# EasyEDA Pro project ZYNQ7020核心板配套底板1.0.epro, board PCB1
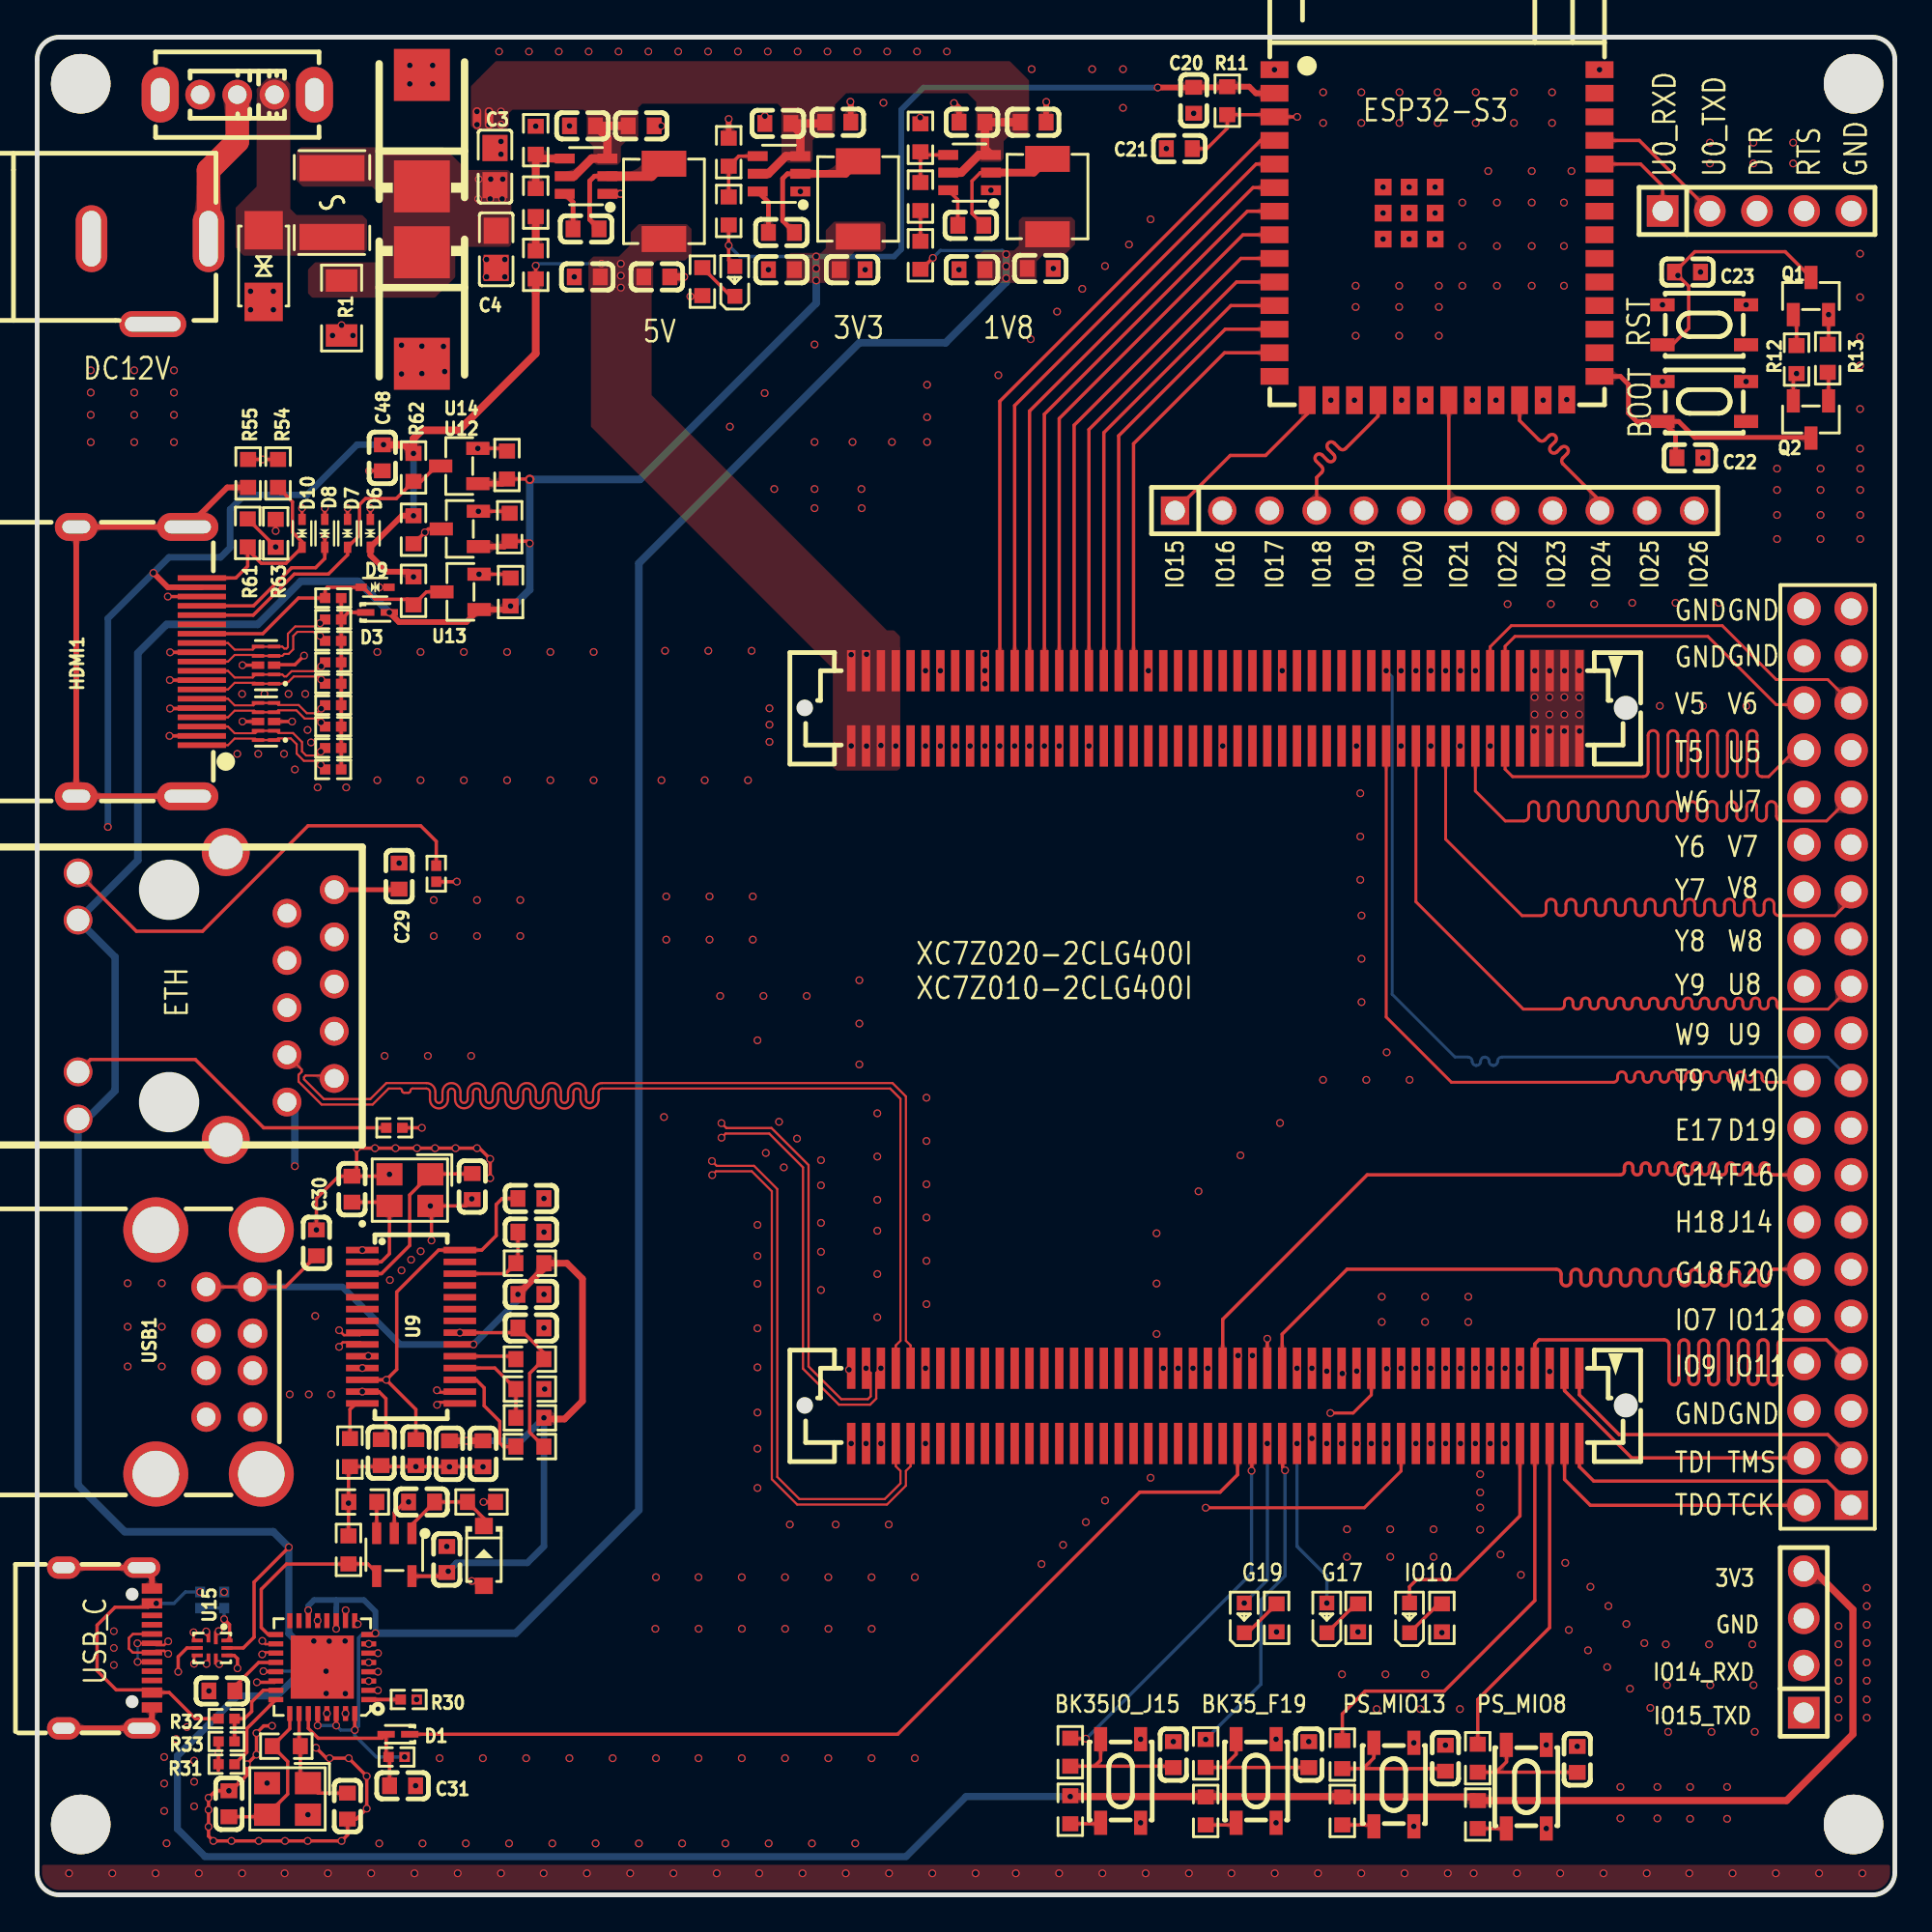
[diagram p9: board, top side]
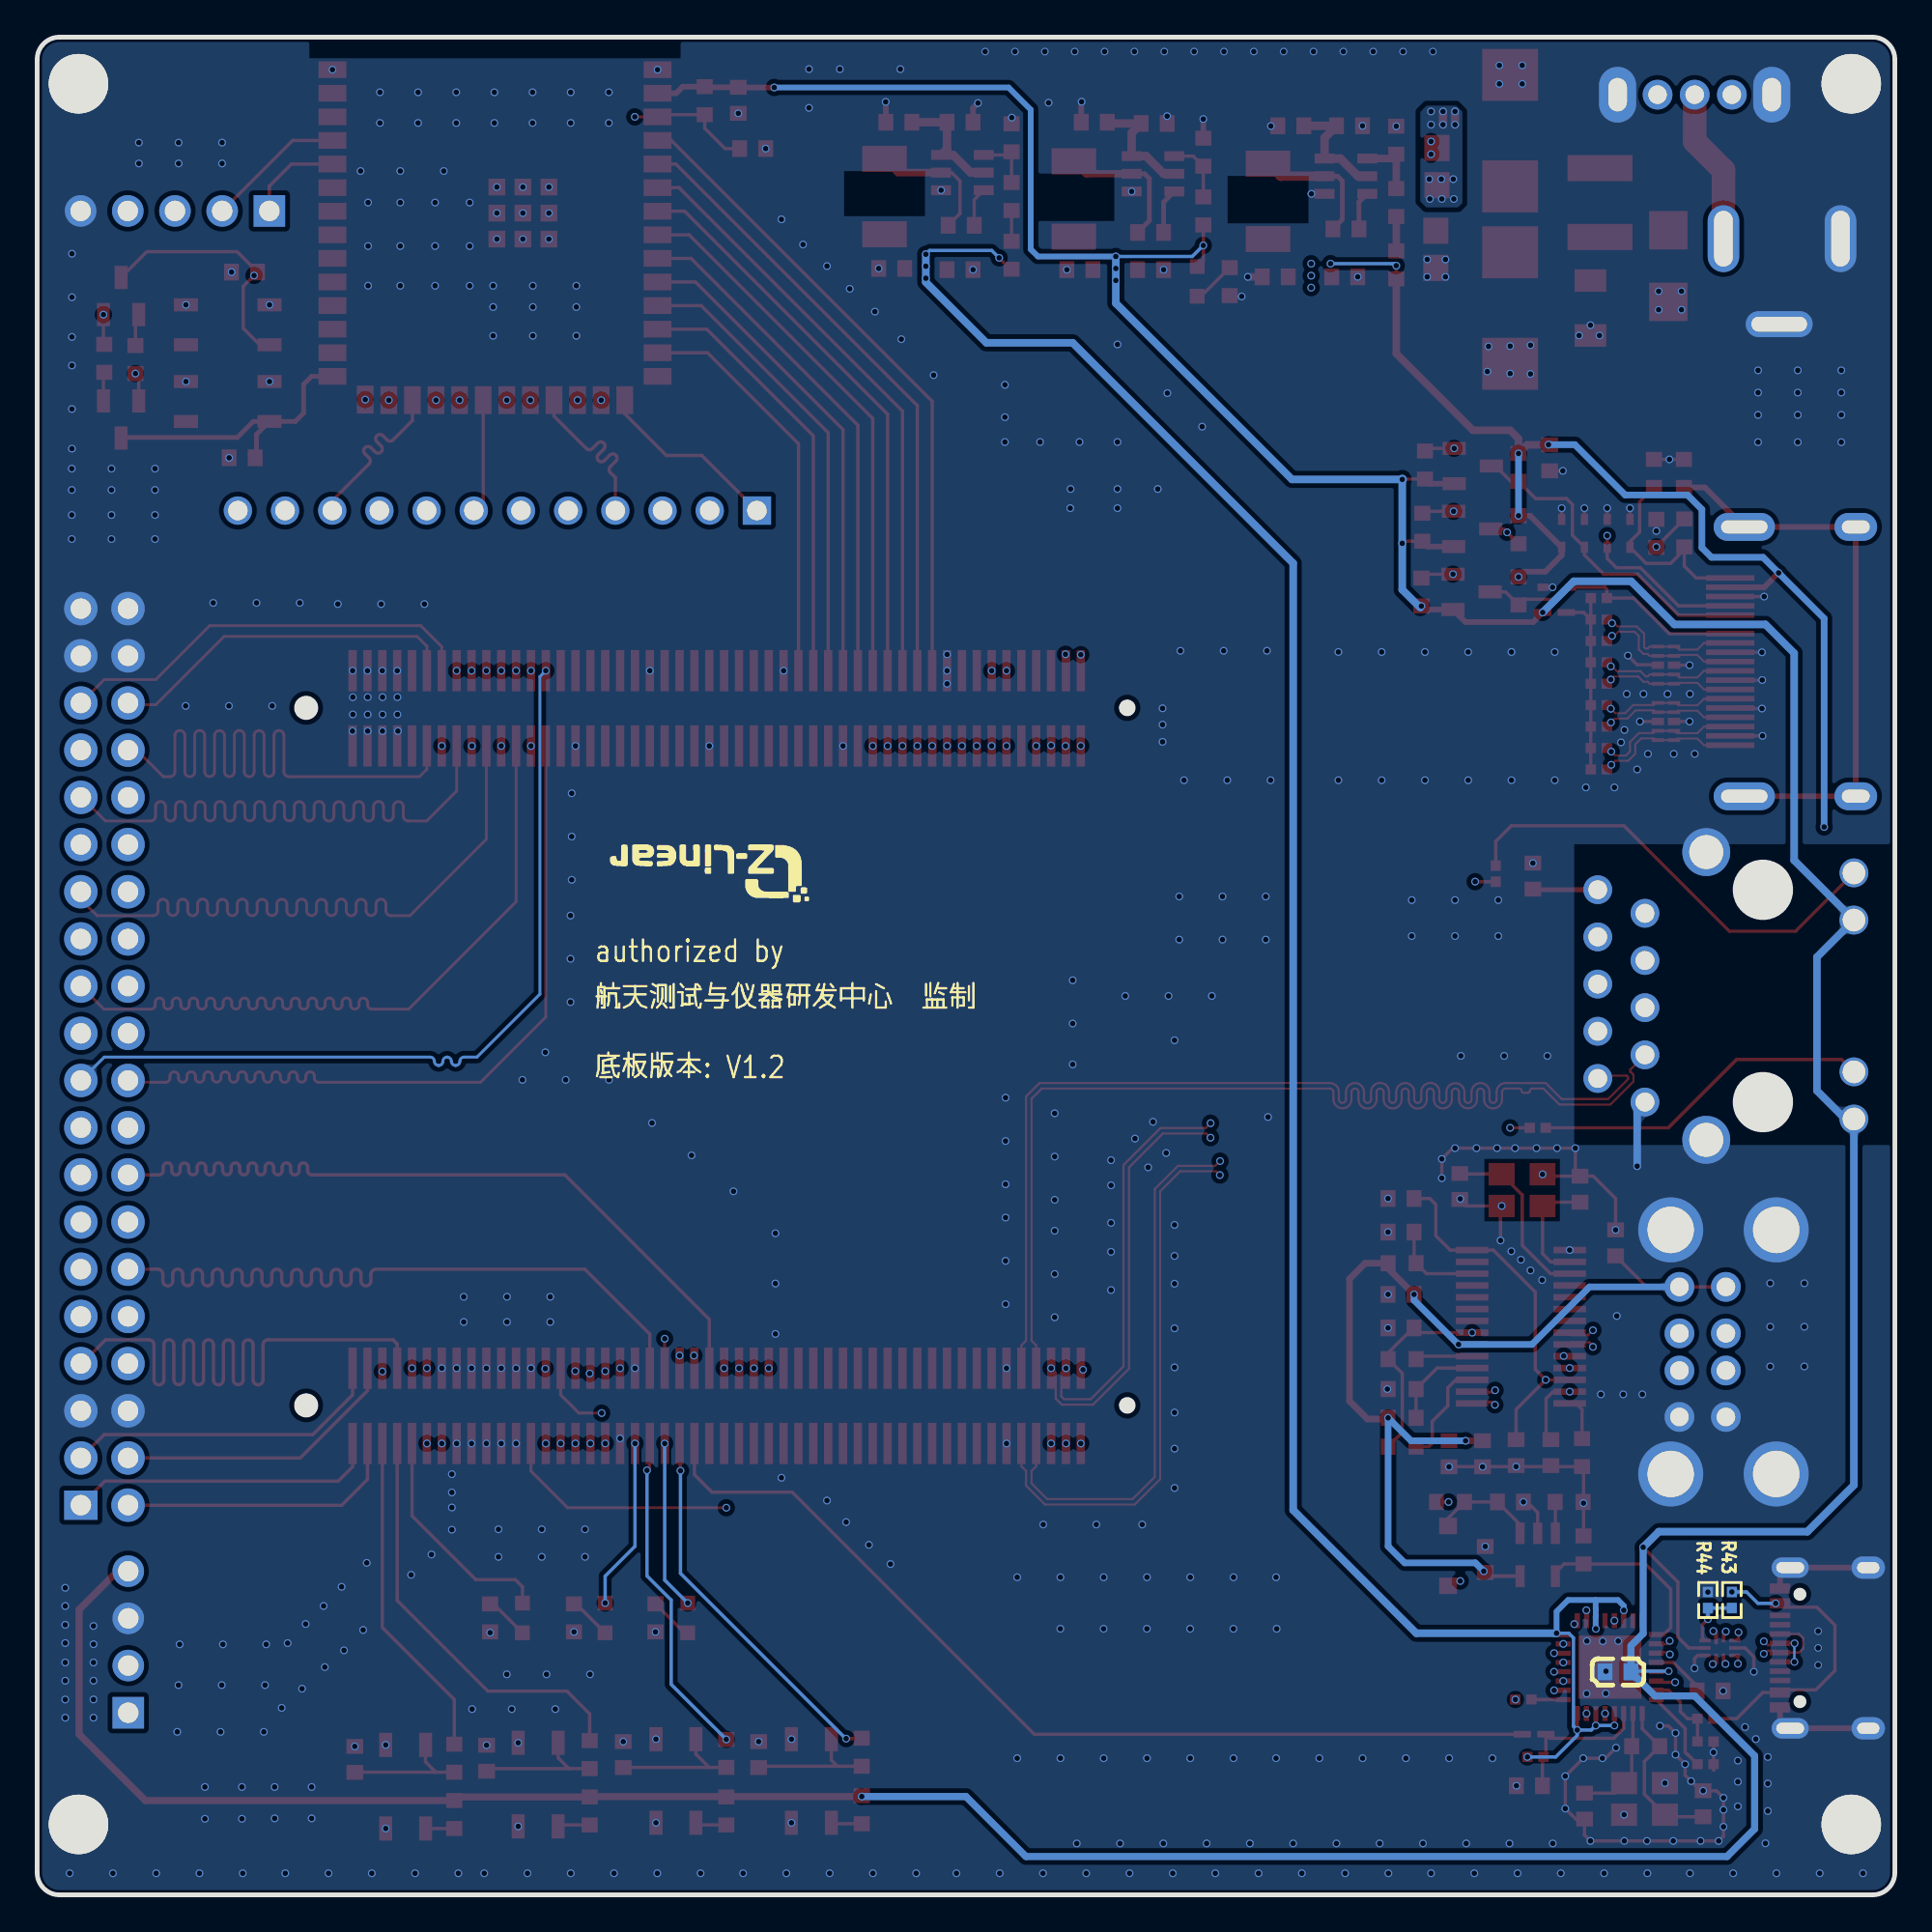
[diagram p10: board, bottom side, seen from below]

Outline 100 x 100 mm; copper layers: Top Layer, Inner1, Inner2, Inner3, Inner4, Bottom Layer. Coordinates in mm from the lower left corner of the outline.
Outline path: 0,98.8 arc(0.35,99.65) 1.2,100 98.8,100 arc(99.65,99.65) 100,98.8 100,1.2 arc(99.65,0.35) 98.8,0 1.2,0 arc(0.35,0.35) 0,1.2 0,98.8
Stack: Top Layer 0.035mm 外层铜厚1oz / Dielectric1 0.0994mm 3313 RC57% 4.2mil / Inner1 0.0152mm 内层铜厚 / Dielectric2 0.55mm 0.55mm H/H No copper / Inner2 0.0152mm 内层铜厚 / Dielectric3 0.1088mm 2116 RC54% 4.9mil / Inner3 0.0152mm 内层铜厚 / Dielectric4 0.55mm 0.55mm H/H No copper / Inner4 0.0152mm 内层铜厚 / Dielectric5 0.0994mm 3313 RC57% 4.2mil / Bottom Layer 0.035mm 外层铜厚1oz

## Design rules (mm)
net $2N1180: ESP32-1
net $2N1190: ESP32-1
net OTG_DM: USB_OTG
net OTG_DP: USB_OTG
net HOST_DP: USB_HOST
net SLAVE_DP: USB_SLAVE
net SLAVE_DM: USB_SLAVE
net HOST_DM: USB_HOST
net DM1: USB_HOST_F1
net DP1: USB_HOST_F1
net DM2: USB_HOST_F2
net DP2: USB_HOST_F2
net BK13_V5: Pin_OUT
net BK13_T5: Pin_OUT
net BK13_V6: Pin_OUT
net BK13_U5: Pin_OUT
net BK13_W6: Pin_OUT
net BK13_U7: Pin_OUT
net BK13_Y6: Pin_OUT
net BK13_V7: Pin_OUT
net BK13_Y7: Pin_OUT
net BK13_V8: Pin_OUT
net BK13_Y8: Pin_OUT
net BK13_W8: Pin_OUT
net BK13_Y9: Pin_OUT
net BK13_U8: Pin_OUT
net BK13_W9: Pin_OUT
net BK13_U9: Pin_OUT
net BK13_W10: Pin_OUT
net BK13_T9: Pin_OUT
net PS500_MIO9: Pin_OUT
net PS500_MIO11: Pin_OUT
net PS500_MIO7: Pin_OUT
net PS500_MIO12: Pin_OUT
net PS501_MIO35_OTG_D3: USB_DATA
net PS501_MIO37_OTG_D5: USB_DATA
net PS501_MIO38_OTG_D6: USB_DATA
net PS501_MIO34_OTG_D2: USB_DATA
net PS501_MIO36_OTG_CLK: USB_DATA
net PS501_MIO32_OTG_D0: USB_DATA
net PS501_MIO29_OTG_DIR: USB_DATA
net PS501_MIO33_OTG_D1: USB_DATA
net PS501_MIO30_OTG_STP: USB_DATA
net PS501_MIO28_OTG_D4: USB_DATA
net PS501_MIO31_OTG_NXT: USB_DATA
net PS501_MIO39_OTG_D7: USB_DATA
net BK35_G18: Pin_OUT
net BK35_F20: Pin_OUT
net BK35_H18: Pin_OUT
net BK35_J14: Pin_OUT
net BK35_IO_0--G14: Pin_OUT
net BK35_F16: Pin_OUT
net BK35_D19: Pin_OUT
net PHY_MDI3_N: PHY_MDI3
net PHY_MDI1_N: PHY_MDI1
net PHY_MDI3_P: PHY_MDI3
net PHY_MDI1_P: PHY_MDI1
net PHY_MDI2_N: PHY_MDI2
net PHY_MDI0_N: PHY_MDI0
net PHY_MDI2_P: PHY_MDI2
net PHY_MDI0_P: PHY_MDI0
net HDMI_TX2_P: HDMI_TX2
net HDMI_TX2_N: HDMI_TX2
net HDMI_TX1_P: HDMI_TX1
net HDMI_TX1_N: HDMI_TX1
net HDMI_TX0_P: HDMI_TX0
net HDMI_TX0_N: HDMI_TX0
net HDMI_TXC_N: HDMI_TXC
net HDMI_TXC_P: HDMI_TXC
net $2N3028: ESP32-1
net $2N3030: ESP32-1
net $2N3032: ESP32-1
net $2N3034: ESP32-1
net $2N3036: ESP32-1
net $2N3038: ESP32-1
net $2N3040: ESP32-1
net $2N3042: ESP32-1
net $2N3044: ESP32-1
net $2N3046: ESP32-1
net $2N3048: ESP32-1
net $2N3050: ESP32-1
template: 自定义配置
spacing copperThickness1oz (default): track to track 0.165, other pairs 0.14 to 0.3
spacing copperThickness2oz: track to track 0.203, other pairs 0.152 to 0.3
track width copperThickness1oz (default): min 0.102, default 0.178, max 2.54
track width USB_DATA: min 0.163, default 0.163, max 0.165
track width PWR_5V: min 0.127, default 0.356, max 2.54
differential pair differentialPair (default): width min 0.102, default 0.102, max 2.54; gap min 0.178, default 0.178
differential pair USB_SLAVE1: width min 0.13, default 0.13, max 0.132; gap min 0.178, default 0.178
differential pair USB_OTG: width min 0.13, default 0.13, max 0.132; gap min 0.178, default 0.178
differential pair USB_HOST: width min 0.15, default 0.15, max 0.152; gap min 0.178, default 0.178
differential pair HDMI_TX2: width min 0.109, default 0.109, max 0.117; gap min 0.178, default 0.178
differential pair HDMI_TX1: width min 0.107, default 0.109, max 0.117; gap min 0.178, default 0.178
differential pair HDMI_TX0: width min 0.107, default 0.109, max 0.117; gap min 0.178, default 0.178
differential pair PHY_MDI1: width min 0.114, default 0.114, max 0.114; gap min 0.178, default 0.178
differential pair PHY_MDI2: width min 0.119, default 0.119, max 0.119; gap min 0.178, default 0.178
differential pair PHY_MDI3: width min 0.117, default 0.117, max 0.119; gap min 0.178, default 0.178
via viaSize (default): diameter min 0.401, default 0.406, max 10; hole min 0.302, default 0.302, max 6.299
net class USB_DATA uses USB_DATA
net 5V uses PWR_5V
net OTG_DM uses USB_OTG
net OTG_DP uses USB_OTG
net HOST_DP uses USB_HOST
net SLAVE_DP uses USB_SLAVE1
net SLAVE_DM uses USB_SLAVE1
net HOST_DM uses USB_HOST
net DM1 uses USB_OTG
net DP1 uses USB_OTG
net DM2 uses USB_OTG
net DP2 uses USB_OTG
net PS501_MIO35_OTG_D3 uses USB_DATA
net PS501_MIO37_OTG_D5 uses USB_DATA
net PS501_MIO38_OTG_D6 uses USB_DATA
net PS501_MIO34_OTG_D2 uses USB_DATA
net PS501_MIO36_OTG_CLK uses USB_DATA
net PS501_MIO32_OTG_D0 uses USB_DATA
net PS501_MIO29_OTG_DIR uses USB_DATA
net PS501_MIO33_OTG_D1 uses USB_DATA
net PS501_MIO30_OTG_STP uses USB_DATA
net PS501_MIO28_OTG_D4 uses USB_DATA
net PS501_MIO31_OTG_NXT uses USB_DATA
net PS501_MIO39_OTG_D7 uses USB_DATA
net PHY_MDI3_N uses PHY_MDI3
net PHY_MDI1_N uses PHY_MDI1
net PHY_MDI3_P uses PHY_MDI3
net PHY_MDI1_P uses PHY_MDI1
net PHY_MDI2_N uses PHY_MDI2
net PHY_MDI0_N uses PHY_MDI2
net PHY_MDI2_P uses PHY_MDI2
net PHY_MDI0_P uses PHY_MDI2
net HDMI_TX2_P uses HDMI1, HDMI_TX2
net HDMI_TX2_N uses HDMI1, HDMI_TX2
net HDMI_TX1_P uses HDMI1, HDMI_TX1
net HDMI_TX1_N uses HDMI1, HDMI_TX1
net HDMI_TX0_P uses HDMI1, HDMI_TX0
net HDMI_TX0_N uses HDMI1, HDMI_TX0
net HDMI_TXC_N uses HDMI1, HDMI_TX0
net HDMI_TXC_P uses HDMI1, HDMI_TX0
diff pair USB_OTG uses USB_OTG
diff pair USB_HOST uses USB_HOST
diff pair USB_SLAVE uses USB_SLAVE1
diff pair USB_HOST_F1 uses USB_OTG
diff pair USB_HOST_F2 uses USB_OTG
diff pair PHY_MDI3 uses PHY_MDI3
diff pair PHY_MDI1 uses PHY_MDI1
diff pair PHY_MDI2 uses PHY_MDI2
diff pair PHY_MDI0 uses PHY_MDI2
diff pair HDMI_TX2 uses HDMI_TX2
diff pair HDMI_TX1 uses HDMI_TX1
diff pair HDMI_TX0 uses HDMI_TX0
diff pair HDMI_TXC uses HDMI_TX0
eq len grp HDMI01 uses HDMI1

## Placement (name value [footprint] x y rotation side)
C1  100uF  [CASE-D_7343]  20.71 94.97 270 top
C2  100uF  [CASE-D_7343]  20.71 85.42 90 top
C3  100nF  [C0805]  24.64 93.03 270 top
C4  100nF  [C0805]  24.71 88.58 90 top
C5  100nF  [C0603]  29.55 89.68 0 top
C6  10uF  [C0603]  32.52 95.23 180 top
C7  100nF  [C0603]  29.35 95.23 0 top
C8  10uF  [C0603]  33.35 87.1 180 top
C9  100nF  [C0603]  29.61 87.1 0 top
C10  100nF  [C0603]  40.06 89.48 0 top
C11  10uF  [C0603]  39.87 95.35 0 top
C12  100nF  [C0603]  43.1 95.42 180 top
C13  10uF  [C0603]  43.87 87.48 180 top
C14  100nF  [C0603]  40.06 87.48 0 top
C15  100nF  [C0603]  50.26 89.87 0 top
C16  10uF  [C0603]  53.61 95.42 180 top
C17  100nF  [C0603]  50.32 95.42 0 top
C18  10uF  [C0603]  54 87.55 180 top
C19  100nF  [C0603]  50.32 87.48 0 top
C20  100nF  [C0603]  62.26 96.6 90 top
C21  100nF  [C0603]  61.48 94 0 top
C22  100nF  [C0603]  88.97 77.35 180 top
C23  100nF  [C0603]  88.84 87.35 180 top
C24  100nF  [C0603]  61.16 7.55 270 top
C25  100nF  [C0603]  68.45 7.55 270 top
C26  100nF  [C0603]  75.81 7.35 270 top
C27  100nF  [C0603]  82.9 7.29 270 top
C29  100nF  [C0603]  19.48 54.84 90 top
C30  100nF  [C0603]  15.03 35.1 90 top
C31  10uF  [C0603]  19.67 5.87 180 top
C32  100nF  [C0603]  24 23.74 90 top
C33  20pF  [C0603]  10.32 4.9 270 top
C34  20pF  [C0603]  16.7 4.78 90 top
C35  100nF  [C0603]  9.94 10.98 0 top
C36  100nF  [C0603]  26.58 37.48 0 top
C37  100nF  [C0603]  26.58 35.68 0 top
C38  100nF  [C0603]  26.58 30.52 0 top
C39  100nF  [C0603]  22.19 23.74 270 top
C40  100nF  [C0603]  26.58 32.32 180 top
C41  100nF  [C0603]  20.39 23.81 270 top
C42  100nF  [C0603]  18.52 23.81 270 top
C43  100nF  [C0603]  20.69 21.15 180 top
C44  18pF  [C0603]  23.42 38.13 270 top
C45  18pF  [C0603]  16.95 37.99 90 top
C46  100nF  [C0603]  22.05 18.05 90 top
C47  100nF  [C0603]  14.9 12 0 bottom
C48  100nF  [C0603]  18.58 77.35 90 top
CN1  IPCB08371FA0S7V  [CONN-SMD_100P-P0.80_10144517-103XXX]  63.42 26.32 0 top
CN2  IPCB08371FA0S7V  [CONN-SMD_100P-P0.80_10144517-103XXX]  63.42 63.87 0 top
D1  RB521S-30  [SOD-523_L1.2-W0.8-LS1.6-RD]  19.42 8.65 180 top
D2  1N4148W  [SOD-123_L2.7-W1.6-LS3.7-FD]  24.05 18.25 90 top
D3  RB521S-30  [SOD-523_L1.2-W0.8-LS1.6-RD]  18.32 69.03 0 top
D4  RCLAMP0524P  [DFN2510-10_L2.5-W1.0-P0.50-BL]  12.32 63.16 90 top
D5  RCLAMP0524P  [DFN2510-10_L2.5-W1.0-P0.50-BL]  12.32 66.19 90 top
D6  TPESD5B5.0ST1G  [SOD-523_L1.2-W0.8-LS1.6-BI]  17.94 73.29 270 top
D7  TPESD5B5.0ST1G  [SOD-523_L1.2-W0.8-LS1.6-BI]  16.71 73.29 270 top
D8  TPESD5B5.0ST1G  [SOD-523_L1.2-W0.8-LS1.6-BI]  15.48 73.29 270 top
D9  TPESD5B5.0ST1G  [SOD-523_L1.2-W0.8-LS1.6-BI]  18.19 70.39 180 top
D10  TPESD5B5.0ST1G  [SOD-523_L1.2-W0.8-LS1.6-BI]  14.26 73.29 270 top
F1  SMD1812P150TF/24  [F1812]  15.87 91.1 90 top
H1  PZ254V-11-05P  [HDR-TH_5P-P2.54-V-M]  92.58 90.64 0 top
H2  PZ254V-11-04P  [HDR-TH_4P-P2.54-V-M]  95.1 13.61 90 top
H3  PZ254V-11-12P  [HDR-TH_12P-P2.54-V-M]  75.23 74.52 0 top
HDMI1  HDMI 19PIN 043  [HDMI-SMD_HDMI-19PIN-043]  5.48 66.39 270 top
L1  3.3uH  [IND-SMD_L4.4-W4.2-A]  33.74 91.16 90 top
L2  3.3uH  [IND-SMD_L4.4-W4.2-A]  44.19 91.29 90 top
L3  3.3uH  [IND-SMD_L4.4-W4.2-A]  54.39 91.42 90 top
LED1  -  [LED_0603]  37.55 86.9 90 top
LED2  -  [LED_0603]  64.97 14.96 90 top
LED3  -  [LED_0603]  69.42 14.96 90 top
LED4  -  [LED_0603]  73.87 14.96 90 top
Q1  SS8050  [SOT-23-3_L2.9-W1.3-P1.90-LS2.4-BR]  95.48 86.06 270 top
Q2  SS8050  [SOT-23-3_L2.9-W1.3-P1.90-LS2.4-BR]  95.48 79.42 90 top
R1  RL1206A180K  [R1206]  16.39 85.42 90 top
R2  115kΩ  [R0603]  26.84 91.1 270 top
R3  115kΩ  [R0603]  26.84 87.74 270 top
R4  20kΩ  [R0603]  26.84 94.45 270 top
R5  100kΩ  [R0603]  37.23 90.64 270 top
R6  30kΩ  [R0603]  37.23 93.81 270 top
R7  40.2kΩ  [R0603]  47.55 91.42 270 top
R8  40.2kΩ  [R0603]  47.55 88.26 270 top
R9  30kΩ  [R0603]  47.55 94.58 270 top
R10  4.7kΩ  [R0603]  35.81 86.84 90 top
R11  10kΩ  [R0603]  64.06 96.58 90 top
R12  10kΩ  [R0603]  94.71 82.64 270 top
R13  10kΩ  [R0603]  96.39 82.71 90 top
R14  4.7kΩ  [R0603]  55.61 4.58 270 top
R15  1kΩ  [R0603]  55.61 7.68 270 top
R16  4.7kΩ  [R0603]  66.72 14.91 90 top
R17  4.7kΩ  [R0603]  62.9 4.52 270 top
R18  1kΩ  [R0603]  62.9 7.61 270 top
R19  4.7kΩ  [R0603]  71.1 14.91 90 top
R20  4.7kΩ  [R0603]  70.26 4.52 270 top
R21  1kΩ  [R0603]  70.26 7.55 270 top
R22  4.7kΩ  [R0603]  75.62 14.91 90 top
R23  4.7kΩ  [R0603]  77.55 4.32 270 top
R24  1kΩ  [R0603]  77.55 7.35 270 top
R26  240Ω  [R0402]  19.23 41.29 0 top
R27  240Ω  [R0402]  21.48 54.97 270 top
R28  1.5kΩ  [R0402]  19.35 7.42 0 top
R29  1MΩ  [R0603]  13.41 8 180 top
R30  33Ω  [R0402]  20 10.52 180 top
R31  10kΩ  [R0402]  10.19 7.03 180 top
R32  1kΩ  [R0402]  10.19 9.48 180 top
R33  10kΩ  [R0402]  10.19 8.26 180 top
R34  10kΩ  [R0603]  26.53 34 180 top
R35  100kΩ  [R0603]  26.53 28.84 180 top
R36  100kΩ  [R0603]  26.53 24.13 180 top
R37  47kΩ  [R0603]  26.53 25.68 0 top
R38  100kΩ  [R0603]  26.53 27.23 180 top
R39  2.7kΩ  [R0603]  16.84 23.81 270 top
R40  1kΩ  [R0603]  23.92 21.15 0 top
R41  10kΩ  [R0603]  16.76 18.57 270 top
R42  13.7kΩ  [R0603]  17.53 21.15 0 top
R43  1kΩ  [R0402]  8.77 15.87 90 bottom
R44  10kΩ  [R0402]  10.06 15.87 90 bottom
R45  49.9Ω  [R0402]  15.94 60.58 0 top
R46  49.9Ω  [R0402]  15.94 61.73 0 top
R47  49.9Ω  [R0402]  15.94 62.89 0 top
R48  49.9Ω  [R0402]  15.94 64.04 0 top
R49  49.9Ω  [R0402]  15.94 65.19 0 top
R50  49.9Ω  [R0402]  15.94 66.35 0 top
R51  49.9Ω  [R0402]  15.94 67.5 0 top
R52  49.9Ω  [R0402]  15.94 68.65 0 top
R53  49.9Ω  [R0402]  15.94 69.81 0 top
R54  10kΩ  [R0603]  12.97 76.52 270 top
R55  0Ω  [R0603]  11.36 76.52 270 top
R56  4.7kΩ  [R0603]  25.44 73.62 270 top
R57  4.7kΩ  [R0603]  20.26 73.48 90 top
R58  4.7kΩ  [R0603]  25.48 70.13 270 top
R59  4.7kΩ  [R0603]  20.26 70.19 90 top
R60  4.7kΩ  [R0603]  25.29 76.97 270 top
R61  20kΩ  [R0603]  11.33 73.31 90 top
R62  4.7kΩ  [R0603]  20.26 76.84 90 top
R63  20kΩ  [R0603]  12.84 73.29 90 top
RJ1  HY911130A  [RJ45-TH_10P-P2.54-S2.54_L16.1-W21.4_HY911130A]  9.1 48.39 270 top
SW1  TS-KG89S-AT25F  [SW-SMD_4P-L4.2-W3.3-P2.15-LS5.1]  89.74 80.39 0 top
SW2  TS-KG89S-AT25F  [SW-SMD_4P-L4.2-W3.3-P2.15-LS5.1]  89.74 84.52 0 top
SW3  TS-KG89S-AT25F  [SW-SMD_4P-L4.2-W3.3-P2.15-LS5.1]  58.32 6.13 90 top
SW4  TS-KG89S-AT25F  [SW-SMD_4P-L4.2-W3.3-P2.15-LS5.1]  65.62 6.13 90 top
SW5  TS-KG89S-AT25F  [SW-SMD_4P-L4.2-W3.3-P2.15-LS5.1]  73.03 5.94 90 top
SW6  TS-KG89S-AT25F  [SW-SMD_4P-L4.2-W3.3-P2.15-LS5.1]  80.16 5.82 90 top
TP1  -  [M3螺丝]  2.41 3.73 0 top
TP2  -  [M3螺丝]  2.41 97.43 0 top
TP3  -  [M3螺丝]  97.84 97.43 0 top
TP4  -  [M3螺丝]  97.84 3.73 0 top
U1  SS12D07VG4  [SW-TH_SS12D07VG4]  10.77 96.9 180 top
U2  DC005-2.5  [DC-IN-TH_DC005-2.5MM]  6.08 86.85 0 top
U3  SMAJ13CA  [DO-214AC_L4.3-W2.7-LS5.0-BI]  12.19 87.68 90 top
U4  TP6327GS6  [SOT-23-6_L2.9-W1.6-P0.95-LS2.8-BL]  29.55 92.52 90 top
U5  TP6327GS6  [SOT-23-6_L2.9-W1.6-P0.95-LS2.8-BL]  39.93 92.64 90 top
U6  TP6327GS6  [SOT-23-6_L2.9-W1.6-P0.95-LS2.8-BL]  50.19 92.71 90 top
U7  ESP32-S3-WROOM-1-N16R8  [WIRELM-SMD_ESP32-S3-WROOM-1]  75.35 89.35 0 top
U8  USB3320C-EZK  [QFN-32_L5.0-W5.0-P0.50-BL-EP3.4]  15.35 12.26 90 top
U9  FE1.1S-BSOP28BCN  [SSOP-28_L9.9-W3.9-P0.635-LS6.0-BL-1]  20.13 30.58 270 top
U10  LPW5209AB5F  [SOT-23-5_L3.0-W1.7-P0.95-LS2.8-BL]  19.22 18.31 180 top
U12  2SK3018  [SOT-23-3_L2.9-W1.3-P0.95-LS2.4-BR]  22.75 73.53 0 top
U13  2SK3018  [SOT-23-3_L2.9-W1.3-P0.95-LS2.4-BR]  22.79 70.14 0 top
U14  2SK3018  [SOT-23-3_L2.9-W1.3-P0.95-LS2.4-BR]  22.72 76.91 0 top
U15  TS3USB30ERSWR  [UQFN-10_L1.8-W1.4-P0.40-TL]  9.42 13.29 270 top
U16  PZ2.54-2*20  [HDR-TH_40P-P2.54-V-M-R2-C20-S2.54]  96.38 45.11 90 top
USB1  USB-269-BRW  [USB-A-TH_USB-269-BRW]  9.23 29.23 90 top
USB2  TYPE-C 16PIN 2MD(073)  [USB-C-SMD_TYPE-C-6PIN-2MD-073]  3.81 13.29 270 top
X1  24MHz  [CRYSTAL-SMD_4P-L3.2-W2.5-BL]  13.48 5.16 180 top
X2  12MHz  [CRYSTAL-SMD_4P-L3.2-W2.5-BL]  20.06 37.94 180 top

## Footprints (pads in the part's own frame, mm; a bottom-side part is the same pattern mirrored in y, then rotated)
C0603
  rect 0.8x0.9 smd: 1(-0.7,0) 2(0.7,0)
C0805
  rect 1.41x1.35 smd: 1(-1,0) 2(1,0)
CASE-D_7343
  rect 2.799x3.01 smd: 1(3,0) 2(-3,0)
CONN-SMD_100P-P0.80_10144517-103XXX
  rect 0.45x2.22 smd: 1(19.6,2.025) 2(19.6,-2.025) 3(18.8,2.025) 4(18.8,-2.025) 5(18,2.025) 6(18,-2.025) 7(17.2,2.025) 8(17.2,-2.025) 9(16.4,2.025) 10(16.4,-2.025) 11(15.6,2.025) 12(15.6,-2.025) 13(14.8,2.025) 14(14.8,-2.025) 15(14,2.025) 16(14,-2.025) 17(13.2,2.025) 18(13.2,-2.025) 19(12.4,2.025) 20(12.4,-2.025) 21(11.6,2.025) 22(11.6,-2.025) 23(10.8,2.025) 24(10.8,-2.025) 25(10,2.025) 26(10,-2.025) 27(9.2,2.025) 28(9.2,-2.025) 29(8.4,2.025) 30(8.4,-2.025) 31(7.6,2.025) 32(7.6,-2.025) 33(6.8,2.025) 34(6.8,-2.025) 35(6,2.025) 36(6,-2.025) 37(5.2,2.025) 38(5.2,-2.025) 39(4.4,2.025) 40(4.4,-2.025) 41(3.6,2.025) 42(3.6,-2.025) 43(2.8,2.025) 44(2.8,-2.025) 45(2,2.025) 46(2,-2.025) 47(1.2,2.025) 48(1.2,-2.025) 49(0.4,2.025) 50(0.4,-2.025) 51(-0.4,2.025) 52(-0.4,-2.025) 53(-1.2,2.025) 54(-1.2,-2.025) 55(-2,2.025) 56(-2,-2.025) 57(-2.8,2.025) 58(-2.8,-2.025) 59(-3.6,2.025) 60(-3.6,-2.025) 61(-4.4,2.025) 62(-4.4,-2.025) 63(-5.2,2.025) 64(-5.2,-2.025) 65(-6,2.025) 66(-6,-2.025) 67(-6.8,2.025) 68(-6.8,-2.025) 69(-7.6,2.025) 70(-7.6,-2.025) 71(-8.4,2.025) 72(-8.4,-2.025) 73(-9.2,2.025) 74(-9.2,-2.025) 75(-10,2.025) 76(-10,-2.025) 77(-10.8,2.025) 78(-10.8,-2.025) 79(-11.6,2.025) 80(-11.6,-2.025) 81(-12.4,2.025) 82(-12.4,-2.025) 83(-13.2,2.025) 84(-13.2,-2.025) 85(-14,2.025) 86(-14,-2.025) 87(-14.8,2.025) 88(-14.8,-2.025) 89(-15.6,2.025) 90(-15.6,-2.025) 91(-16.4,2.025) 92(-16.4,-2.025) 93(-17.2,2.025) 94(-17.2,-2.025) 95(-18,2.025) 96(-18,-2.025) 97(-18.8,2.025) 98(-18.8,-2.025) 99(-19.6,2.025) 100(-19.6,-2.025)
CRYSTAL-SMD_4P-L3.2-W2.5-BL
  rect 1.4x1.2 smd: 1(-1.1,-0.85) 2(1.1,-0.85) 3(1.1,0.85) 4(-1.1,0.85)
DC-IN-TH_DC005-2.5MM
  oval 3.6x1.4 hole 3x0.8: 2(0.15,-2.3)
  oval 1.7x3.6 hole 1x3: 3(-3.15,2.3) 4(3.15,2.3)
DFN2510-10_L2.5-W1.0-P0.50-BL
  rect 0.2x0.665 smd: 1(-1,-0.433) 2(-0.5,-0.433) 4(0.5,-0.433) 5(1,-0.433) 6(1,0.433) 7(0.5,0.433) 9(-0.5,0.433) 10(-1,0.433)
  rect 0.4x0.665 smd: 3(0,-0.433) 8(0,0.433)
DO-214AC_L4.3-W2.7-LS5.0-BI
  rect 2.07x2.06 smd: 1(-1.929,0) 2(1.929,0)
F1812
  rect 1.407x3.499 smd: 1(-1.853,0) 2(1.853,0)
HDMI-SMD_HDMI-19PIN-043
  rect 0.3x2.6 smd: 1(4.5,3.38) 2(4,3.38) 3(3.5,3.38) 4(3,3.38) 5(2.5,3.38) 6(2,3.38) 7(1.5,3.38) 8(1,3.38) 9(0.5,3.38) 10(0,3.38) 11(-0.5,3.38) 12(-1,3.38) 13(-1.5,3.38) 14(-2,3.38) 15(-2.5,3.38) 16(-3,3.38) 17(-3.5,3.38) 18(-4,3.38) 19(-4.5,3.38)
  oval 1.5x3.3 hole 0.7x2.5: 20(-7.25,2.62) 20(7.25,2.62)
  oval 1.5x2.3 hole 0.7x1.5: 20(-7.25,-3.38) 20(7.25,-3.38)
HDR-TH_4P-P2.54-V-M
  rect 1.7x1.7 hole 1.1: 1(-3.81,0)
  round 1.7 hole 1.1: 2(-1.27,0) 3(1.27,0) 4(3.81,0)
HDR-TH_5P-P2.54-V-M
  rect 1.7x1.7 hole 1.1: 1(-5.08,0)
  round 1.7 hole 1.1: 2(-2.54,0) 3(0,0) 4(2.54,0) 5(5.08,0)
HDR-TH_12P-P2.54-V-M
  rect 1.524x1.524 hole 1.05: 1(-13.97,0)
  round 1.524 hole 1.05: 2(-11.43,0) 3(-8.89,0) 4(-6.35,0) 5(-3.81,0) 6(-1.27,0) 7(1.27,0) 8(3.81,0) 9(6.35,0) 10(8.89,0) 11(11.43,0) 12(13.97,0)
HDR-TH_40P-P2.54-V-M-R2-C20-S2.54
  rect 1.575x1.8 hole 1.1: 1(-24.13,-1.27)
  round 1.8 hole 1.1: 2(-24.13,1.27) 3(-21.59,-1.27) 4(-21.59,1.27) 5(-19.05,-1.27) 6(-19.05,1.27) 7(-16.51,-1.27) 8(-16.51,1.27) 9(-13.97,-1.27) 10(-13.97,1.27) 11(-11.43,-1.27) 12(-11.43,1.27) 13(-8.89,-1.27) 14(-8.89,1.27) 15(-6.35,-1.27) 16(-6.35,1.27) 17(-3.81,-1.27) 18(-3.81,1.27) 19(-1.27,-1.27) 20(-1.27,1.27) 21(1.27,-1.27) 22(1.27,1.27) 23(3.81,-1.27) 24(3.81,1.27) 25(6.35,-1.27) 26(6.35,1.27) 27(8.89,-1.27) 28(8.89,1.27) 29(11.43,-1.27) 30(11.43,1.27) 31(13.97,-1.27) 32(13.97,1.27) 33(16.51,-1.27) 34(16.51,1.27) 35(19.05,-1.27) 36(19.05,1.27) 37(21.59,-1.27) 38(21.59,1.27) 39(24.13,-1.27) 40(24.13,1.27)
IND-SMD_L4.4-W4.2-A
  rect 1.4x2.4 smd: 1(2.028,0) 2(-2.028,0)
LED_0603
  rect 0.8x0.8 smd: 1(-0.851,-0.01) 2(0.75,-0.005)
M3螺丝
  round 3.2 hole 3.2: 1(-0.064,0.064)
QFN-32_L5.0-W5.0-P0.50-BL-EP3.4
  rect 0.28x0.8 smd: 1(-1.75,-2.5) 2(-1.252,-2.5) 3(-0.751,-2.5) 4(-0.252,-2.5) 5(0.248,-2.5) 6(0.749,-2.5) 7(1.248,-2.5) 8(1.748,-2.5) 17(1.752,2.5) 18(1.252,2.5) 19(0.751,2.5) 20(0.252,2.5) 21(-0.248,2.5) 22(-0.749,2.5) 23(-1.248,2.5) 24(-1.748,2.5)
  rect 0.8x0.28 smd: 9(2.5,-1.748) 10(2.5,-1.248) 11(2.5,-0.748) 12(2.5,-0.248) 13(2.5,0.252) 14(2.5,0.752) 15(2.5,1.252) 16(2.5,1.752) 25(-2.5,1.75) 26(-2.5,1.25) 27(-2.5,0.75) 28(-2.5,0.25) 29(-2.5,-0.25) 30(-2.5,-0.75) 31(-2.5,-1.25) 32(-2.5,-1.75)
  rect 3.4x3.4 smd: 33(0,0)
R0402
  rect 0.566x0.54 smd: 1(-0.433,0) 2(0.433,0)
R0603
  rect 0.806x0.864 smd: 1(-0.753,0) 2(0.753,0)
R1206
  rect 1.208x1.701 smd: 1(-1.479,0) 2(1.479,0)
RJ45-TH_10P-P2.54-S2.54_L16.1-W21.4_HY911130A
  round 1.55 hole 1.016: 1(-5.72,6.895) 2(-4.45,4.355) 3(-3.18,6.895) 4(-1.91,4.355) 5(-0.64,6.895) 6(0.63,4.355) 7(1.9,6.895) 8(3.17,4.355) 9(4.44,6.895) 10(5.71,4.355)
  round 1.55 hole 1.219: 11(-6.625,-6.895) 12(-4.085,-6.895) 13(4.085,-6.895) 14(6.625,-6.895)
  round 2.58 hole 1.829: 15(-7.745,1.055) 16(7.745,1.055)
SOD-123_L2.7-W1.6-LS3.7-FD
  rect 0.88x0.96 smd: 1(-1.61,0) 2(1.61,0)
SOD-523_L1.2-W0.8-LS1.6-BI
  rect 0.6x0.4 smd: 1(-0.75,0) 2(0.75,0)
SOD-523_L1.2-W0.8-LS1.6-RD
  rect 0.93x0.36 smd: 1(-0.635,0) 2(0.635,0)
SOT-23-3_L2.9-W1.3-P0.95-LS2.4-BR
  rect 1.25x0.7 smd: 1(1,-0.95) 2(1,0.95) 3(-1,0)
SOT-23-3_L2.9-W1.3-P1.90-LS2.4-BR
  rect 1.25x0.7 smd: 1(1,-0.95) 2(1,0.95) 3(-1,0)
SOT-23-5_L3.0-W1.7-P0.95-LS2.8-BL
  rect 0.49x1.157 smd: 1(-0.95,-1.153) 2(0,-1.153) 3(0.95,-1.153)
  rect 0.49x1.175 smd: 4(0.95,1.153) 5(-0.95,1.153)
SOT-23-6_L2.9-W1.6-P0.95-LS2.8-BL
  rect 0.532x1.072 smd: 1(-0.95,-1.149) 2(0,-1.149) 3(0.95,-1.149) 4(0.95,1.149) 5(0,1.149) 6(-0.95,1.149)
SSOP-28_L9.9-W3.9-P0.635-LS6.0-BL-1
  rect 0.35x1.751 smd: 1(-4.128,-2.626) 2(-3.493,-2.626) 3(-2.857,-2.626) 4(-2.223,-2.626) 5(-1.587,-2.626) 6(-0.953,-2.626) 7(-0.318,-2.626) 8(0.318,-2.626) 9(0.953,-2.626) 10(1.587,-2.626) 11(2.223,-2.626) 12(2.857,-2.626) 13(3.493,-2.626) 14(4.128,-2.626) 15(4.128,2.626) 16(3.493,2.626) 17(2.857,2.626) 18(2.223,2.626) 19(1.587,2.626) 20(0.953,2.626) 21(0.318,2.626) 22(-0.318,2.626) 23(-0.953,2.626) 24(-1.587,2.626) 25(-2.223,2.626) 26(-2.857,2.626) 27(-3.493,2.626) 28(-4.128,2.626)
SW-SMD_4P-L4.2-W3.3-P2.15-LS5.1
  rect 1.3x0.7 smd: 1(-2.25,1.075) 2(2.25,1.075) 3(-2.25,-1.075) 4(2.25,-1.075)
SW-TH_SS12D07VG4
  oval 1.6x1.6 hole 1: 1(-2,0) 2(0,0) 3(2,0)
  oval 2x3 hole 1x1.8: 4(4.15,0) 5(-4.15,0)
UQFN-10_L1.8-W1.4-P0.40-TL
  rect 0.7x0.2 smd: 1(-0.55,0.2)
  rect 0.6x0.2 smd: 2(-0.6,-0.2) 6(0.6,-0.2) 7(0.6,0.2)
  rect 0.2x0.6 smd: 3(-0.4,-0.8) 4(0,-0.8) 5(0.4,-0.8) 8(0.4,0.8) 9(0,0.8) 10(-0.4,0.8)
USB-A-TH_USB-269-BRW
  round 1.6 hole 1: 1(3.5,-2.37) 2(1,-2.37) 3(-1,-2.37) 4(-3.5,-2.37) 5(3.5,0.13) 6(1,0.13) 7(-1,0.13) 8(-3.5,0.13)
  round 3.5 hole 2.5: 9(-6.57,2.84) 10(-6.57,-2.84) 11(6.57,-2.84) 12(6.57,2.84)
USB-C-SMD_TYPE-C-6PIN-2MD-073
  rect 0.55x1.1 smd: 1(-3.2,2.375) 2(-2.4,2.375) 11(2.4,2.375) 12(3.2,2.375)
  rect 0.3x1.1 smd: 3(-1.75,2.375) 4(-1.25,2.375) 5(-0.75,2.375) 6(-0.25,2.375) 7(0.25,2.375) 8(0.75,2.375) 9(1.25,2.375) 10(1.75,2.375)
  oval 1.1x2 hole 0.6x1.5: 13(-4.325,1.825) 14(4.325,1.825)
  oval 1.2x1.8 hole 0.6x1.2: 13(-4.325,-2.375) 14(4.325,-2.375)
WIRELM-SMD_ESP32-S3-WROOM-1
  rect 1.5x0.9 smd: 1(-8.75,8.895) 2(-8.75,7.625) 3(-8.75,6.355) 4(-8.75,5.085) 5(-8.75,3.815) 6(-8.75,2.545) 7(-8.75,1.275) 8(-8.75,0.005) 9(-8.75,-1.265) 10(-8.75,-2.535) 11(-8.75,-3.805) 12(-8.75,-5.075) 13(-8.75,-6.345) 14(-8.75,-7.615) 27(8.75,-7.615) 28(8.75,-6.345) 29(8.75,-5.075) 30(8.75,-3.805) 31(8.75,-2.535) 32(8.75,-1.265) 33(8.75,0.005) 34(8.75,1.275) 35(8.75,2.545) 36(8.75,3.815) 37(8.75,5.085) 38(8.75,6.355) 39(8.75,7.625) 40(8.75,8.895)
  rect 0.9x1.5 smd: 15(-6.985,-8.895) 16(-5.715,-8.895) 17(-4.445,-8.895) 18(-3.175,-8.895) 19(-1.905,-8.895) 20(-0.635,-8.895) 21(0.635,-8.895) 22(1.905,-8.895) 23(3.175,-8.895) 24(4.445,-8.895) 25(5.715,-8.895) 26(6.985,-8.865)
  rect 0.9x0.9 smd: 41(-2.9,2.575) 41(-2.9,1.175) 41(-2.9,-0.225) 41(-1.5,2.575) 41(-1.5,1.175) 41(-1.5,-0.225) 41(-0.1,2.575) 41(-0.1,1.175) 41(-0.1,-0.225)

## Nets
As in the schematic.

Pads without a net: CN2 9 10 91 92; HDMI1 14; SW1 4; SW2 4; U1 3; U7 14 28 29 30 31 32 33 34 35 38 39; U8 12 15 16; U9 4 5 6 7 22 23 24 25 27; USB2 3 4 9 10

## Via types
v1: diameter 0.416, hole 0.302, Top Layer to Bottom Layer, 768 vias
v2: diameter 0.406, hole 0.302, Top Layer to Bottom Layer, 19 vias
v3: diameter 0.508, hole 0.302, Top Layer to Bottom Layer, 1 via
v4: diameter 0.419, hole 0.302, Top Layer to Bottom Layer, 1 via

## Routing (per net, layer and track width the routed paths; a pad name or vN(x,y) marks a point on that pad's centre or on a via; arc(x,y) is an arc through that point)
1V8: length 122.3
  Top Layer w0.178: v1(15.1,9.12) U8.28 ; v1(16.1,9.12) U8.30 ; U8.32 v1(17.1,8.87) ; v1(14.59,15.32) 14.6,15.31 U8.14 ; v1(48.22,88.12) 47.6,87.5 R8.2 ; v1(16.1,14.32) U8.11
  Bottom Layer w0.178: v1(48.22,88.12) 48.61,88.52 51.96,88.52 v1(52.16,88.31) ; v1(17.1,8.87) 16.34,8.87 v1(16.1,9.12) v1(15.1,9.12) ; v1(17.1,8.87) 17.1,8.58 18.26,7.42 v1(19.78,7.42) ; v1(17.1,8.87) 17.3,9.07 17.3,13.83 17.55,14.08 v1(18.21,14.08)
  Bottom Layer w0.305: 16.11,15.87 17.59,15.87 18.21,15.25 v1(18.21,14.08) ; 16.11,15.87 14.9,15.87 14.59,15.56 v1(14.59,15.32) ; 16.11,15.87 16.11,15.4 16.1,15.4 16.1,14.98 16.11,14.98 16.11,14.33 v1(16.09,14.32)
  Bottom Layer w0.406: v1(18.21,14.08) 25.76,14.08 32.39,20.71 32.39,71.68 44.26,83.55 48.9,83.55 52.16,86.81 v1(52.16,87.02) v1(52.16,87.67) v1(52.16,88.31)
3V3: length 292.4
  Top Layer w0.178: U15.9 11.1,13.29 11.68,13.87 11.68,16.84 v1(13.55,18.71) ; R60.2 26.5,76.21 v3(26.52,76.19) ; R5.2 v1(37.23,88.79) 37.23,87.98 LED1.2 ; 25.44,72.87 26.4,72.87 v1(26.52,72.75) ; U8.21 12.21,12.01 v1(12.18,12.04)
  Top Layer w0.305: U12.1 25.15,72.58 25.44,72.87 ; v1(60.32,97.29) 62.25,97.29 C20.2 64.03,97.3 R11.2 65.25,97.33 65.6,96.98 U7.2 ; R60.2 25.04,75.96 U14.1 ; v1(18.96,69.03) 19.47,68.52 23.11,68.52 U13.1 25.3,69.19 v1(25.48,69.38)
  Top Layer w0.381: v1(55.61,5.29) 70.24,5.29 R20.1 77.35,5.27 R23.1 94.17,5.08 97.74,8.65 97.74,15.35 95.67,17.42 H2.4
  Bottom Layer w0.178: v1(41.94,88.19) 37.82,88.19 v1(37.23,88.79) ; 14.13,12 14.09,12.04 v1(12.18,12.04)
  Bottom Layer w0.305: v1(41.94,88.19) 46.13,88.19 46.52,88.58 46.52,96.1 47.71,97.29 v1(60.32,97.29)
  Bottom Layer w0.381: v1(13.55,18.71) 13.55,14.06 14.2,13.41 C47.1 12.91,10.71 10.77,10.71 7.55,7.48 7.55,3.55 9.03,2.06 46.77,2.06 50,5.29 v1(55.61,5.29)
  Bottom Layer w0.406: v1(18.96,69.03) 17.28,70.71 14.19,70.71 11.87,68.39 6.97,68.39 5.42,66.84 5.42,55.69 RJ1.12 4.19,50.48 4.19,43.29 2.67,41.76 RJ1.14 2.2,22.06 4.71,19.55 12.71,19.55 v1(13.55,18.71) ; v1(41.94,88.19) v1(41.94,87.55) v1(41.94,86.9) 41.94,85.68 32.45,76.19 v3(26.52,76.19) v1(26.52,72.75) 26.52,70.26 25.55,69.29
5V: length 148.4
  Top Layer w0.178: C30.1 13.36,32.73 USB1.1 USB1.5 ; R3.2 v1(26.84,87.7)
  Top Layer w0.203: C46.1 21.85,17.16 U10.5
  Top Layer w0.305: HDMI1.18 7.03,70.39 v1(6.26,71.16) ; v1(20.26,74.24) 19.63,74.24 D6.2 17.94,72.11 18.82,71.23 19.98,71.23 v1(20.26,70.95)
  Top Layer w0.355: C39.1 v1(23.11,24.44) C32.2 ; v1(25.88,32.32) 27.28,33.72 R34.1 28.52,34 29.35,33.16 29.35,26.58 28.39,25.61 27.34,25.61 v1(27.28,25.68)
  Top Layer w0.406: R3.2 26.84,82.97 22.71,78.84 20.71,78.84 20.26,78.39 v1(20.26,77.59) 19.8,78.05 C48.2
  Inner3 w0.355: v1(3.81,57.48) 4.77,56.52 4.77,41.42 9.1,37.1 USB1.5
  Bottom Layer w0.178: v1(30.38,87.81) 26.95,87.81 v1(26.84,87.7)
  Bottom Layer w0.355: v1(18.64,78.06) 17.23,78.06 14.52,75.35 11.16,75.35 10.39,74.58 10.39,72.52 9.87,72 7.1,72 v1(6.26,71.16) 3.81,68.71 v1(3.81,57.48) ; v1(25.88,32.32) 25.88,32.01 23.5,29.63 v1(23.49,29.63) 19.53,29.63 16.44,32.73 USB1.1 ; v1(20.26,74.24) v1(20.26,77.59) ; v1(23.11,24.44) 26.04,24.44 v1(27.28,25.68) 27.28,18.76 26.39,17.87 22.58,17.87 v1(22.13,17.42)
  vias: v1(31.42,87.81) v1(31.42,87.16) v1(31.42,86.52) v1(43.82,66.76) v1(43.82,61.85) v1(44.65,66.78) v1(44.65,61.84) v1(45.42,61.87) v1(46.22,61.85)
12V: length 20.9
  Top Layer w0.457: v1(23.68,95.29) v1(23.68,96) ; C16.2 C17.2 51.02,93.98 U6.3 50.69,93.66 49.74,92.71 U6.5 ; v1(24.32,95.29) v1(24.32,96) ; C6.2 30.06,95.23 30.7,94.58 U4.3 29.85,93.47 28.9,92.52 U4.5 ; C12.2 42.33,95.35 C11.2 41.08,94.84 U5.3 40.3,93.59 39.35,92.64 U5.5
  vias: v1(23.74,91.29) v1(23.77,92.36) v1(24.42,92.36) v1(24.39,91.29) v1(24.97,96) v1(24.97,95.29) v1(25.03,91.29) v1(25.06,92.36)
GND: length 102.8
  Top Layer w0.178: v1(20,21.15) 19.79,21.15 19.23,20.58 19.23,19.46 ; v1(24,23.04) 23.99,23.05 v1(20.39,23.05) R39.2 16.76,22.97 v1(16.76,21.08) 16.76,19.32 ; C45.2 18.86,38.69 v1(18.96,38.79) ; C45.2 17.2,38.94 v1(17.2,40.19) v1(18.19,40.19) v1(19.29,40.19) v1(20.44,40.19) v1(21.42,40.19) v1(22.52,40.19) v1(23.68,40.19) 23.81,40.19 v1(24.39,39.61) v1(24.39,38.58) ; C45.2 16.23,38.69 15.03,37.48 v1(15.03,35.8) ; D4.3 v1(13.72,63.16) ; v1(10.78,12.19) 10.78,12.72 10.61,12.89 U15.8 ; v1(21.23,35.23) 21.23,37.02 v1(21.16,37.09) 23.08,37.09 C44.2 ; v1(12.64,9.1) 12.19,9.1 v1(11.81,8.71) v1(11.81,7.55) v1(11.29,7.03) 11.29,6.44 v1(10.97,6.12) 10.45,5.6 v1(10.32,5.6) 9.6,5.6 v1(9.23,5.23) v1(9.23,4.58) v1(9.23,3.67) 9.23,3.16 v1(9.48,2.9) v1(10.46,2.9) v1(11.93,2.9) v1(13.34,2.9) v1(14.56,2.9) v1(16.39,2.9) 16.71,3.23 16.71,4.07 C34.1 17.17,4.08 v1(17.74,4.65) v1(17.74,6.39) v1(16.77,7.35) v1(15.74,7.35) 15.57,7.35 v1(15.01,7.92) ; HDMI1.11 v1(7.16,66.89) ; v1(17.94,74.64) D6.1 ; v1(11.05,63.16) D4.8 ; HDMI1.17 v1(7.04,69.89) ; v1(11.05,66.19) D5.8 ; v1(35.16,86.04) 35.76,86.04 R10.1 ; v1(12.84,73.42) R63.2 ; U15.4 8.06,13.29 7.59,12.82 v1(7.59,12.01) ; v1(7.14,65.39) 7.15,65.39 HDMI1.8 ; v1(18.43,70.39) D9.1 ; R33.2 v1(9.76,7.67) R31.2 9.76,6.73 9.74,6.71 ; C6.1 33.23,95.22 v1(33.59,95.22) ; R54.1 v1(12.14,77.27) R55.1 ; HDMI1.5 8.84,63.86 v1(7.15,63.86) ; D7.1 16.71,74.64 v1(16.71,74.64) ; v1(17.87,76.65) C48.1 ; HDMI1.2 v1(7.12,62.39) ; D8.1 v1(15.48,74.64) ; v1(14.37,66.71) 13.88,66.22 12.78,66.22 D5.3 ; v1(14.26,74.64) D10.1
  Top Layer w0.305: USB2.1 6.18,17.07 USB2.13 USB2.13 ; C17.1 49.62,96.18 v1(49.35,96.45) ; v1(39.17,95.75) 39.17,95.36 C11.1 ; R9.1 47.54,95.35 v1(47.54,95.67) ; C16.1 54.31,96.51 v1(54.32,96.52) ; USB2.12 6.18,9.51 USB2.14 USB2.14 ; R6.1 v1(37.23,95.59) ; v1(43.78,96.53) 43.8,96.51 C12.1
  Top Layer w0.406: 34.06,87.1 v1(34.83,87.1) ; v1(31.41,91.57) U4.1
  Bottom Layer w0.406: v1(13.87,39.23) 13.87,42.26 RJ1.10
  vias: v1(1.72,1.16) v1(2.88,82.06) v1(2.88,80.87) v1(2.88,79.67) v1(2.88,78.2) v1(4.04,1.16) v1(4.87,32.92) v1(4.87,30.58) v1(4.87,28.44) v1(5.23,82.06) v1(5.23,80.87) v1(5.23,79.67) v1(5.23,78.2) v1(6.37,1.16) v1(6.71,32.92) v1(6.71,30.58) v1(6.71,28.44) v1(6.84,7.42) v1(6.84,5.99) v1(6.84,4.51) v1(6.97,2.77) v1(7.36,82.06) v1(7.36,80.87) v1(7.36,79.67) v1(7.36,78.2) v1(7.48,8.39) v1(8.06,9.03) v1(8.45,7.23) v1(8.45,6.09) v1(8.45,4.76) v1(8.7,1.16) v1(9.25,10.98) v1(10.06,16.3) v1(10.77,61.42) v1(11.03,64.64) v1(11.03,1.16) v1(11.48,86.32) v1(11.48,85.33) v1(11.9,61.42) v1(12.23,64.64) v1(12.38,6.01) v1(12.72,86.32) v1(12.72,85.33) v1(13.29,61.42) v1(13.32,1.16) v1(13.53,64.64) v1(13.59,26.94) v1(13.87,60.58) v1(14.43,64.64) v1(14.56,62.71) v1(14.62,26.94) v1(14.58,4.31) v1(14.74,62.04) v1(14.89,13.66) v1(14.97,31.16) v1(15.1,59.61) v1(15.55,12.04) v1(15.56,10.84) v1(15.72,13.65) v1(15.65,1.16) v1(15.83,26.94) v1(15.9,83.94) v1(16.39,84.5) v1(16.63,59.61) v1(16.58,13.66) v1(16.59,10.83) v1(17,83.94) v1(17.5,34.71) v1(17.98,1.16) v1(18.31,66.9) v1(18.31,60) v1(18.42,2.77) v1(18.7,45.16) v1(18.99,33.09) v1(19.48,55.54) v1(19.61,83.42) v1(19.61,81.87) v1(19.61,33.61) v1(20.06,98.48) v1(20.06,97.48) v1(20.13,34.19) v1(20.31,1.16) v1(20.37,5.87) v1(20.64,66.9) v1(20.64,60) v1(20.64,34.64) v1(20.71,83.37) v1(20.71,81.89) v1(20.74,2.77) v1(21.03,45.16) v1(21.29,98.48) v1(21.29,97.48) v1(21.35,53.55) v1(21.35,51.61) v1(21.66,7.35) v1(21.87,83.35) v1(21.94,82) v1(22.05,18.75) v1(22.19,23.04) v1(22.64,1.16) v1(22.97,66.9) v1(22.97,60) v1(23.07,2.77) v1(23.36,45.16) v1(23.4,37.47) v1(23.68,53.55) v1(23.68,51.61) v1(23.99,7.35) v1(24.19,88.03) v1(24.19,87.1) v1(24.97,94.39) v1(24.97,93.7) v1(24.97,1.16) v1(25.17,88.03) v1(25.17,87.1) v1(25.3,66.9) v1(25.3,60) v1(25.4,2.77) v1(26.01,53.55) v1(26.01,51.61) v1(26.32,7.35) v1(26.84,95.2) v1(27.28,37.48) v1(27.28,35.68) v1(27.28,32.32) v1(27.28,30.52) v1(27.32,27.23) v1(27.26,1.16) v1(27.63,66.9) v1(27.63,60) v1(27.73,2.77) v1(28.66,95.23) v1(28.65,7.35) v1(28.91,87.1) v1(29.59,1.16) v1(29.96,66.9) v1(29.96,60) v1(30.06,2.77) v1(30.98,7.35) v1(31.92,1.16) v1(32.39,2.77) v1(33.31,17.1) v1(33.28,14.32) v1(33.31,7.35) v1(33.61,60) v1(33.74,41.87) v1(33.8,66.97) v1(33.86,53.74) v1(33.86,51.42) v1(34.25,1.16) v1(34.72,2.77) v1(35.6,17.1) v1(35.61,14.32) v1(35.6,7.35) v1(35.94,60) v1(36.13,66.97) v1(36.19,53.74) v1(36.19,51.42) v1(36.58,1.16) v1(36.77,48.39) v1(37.05,2.77) v1(37.29,79.03) v1(37.93,17.1) v1(37.94,14.32) v1(37.93,7.35) v1(38.26,60) v1(38.46,66.97) v1(38.52,53.74) v1(38.52,51.42) v1(38.77,46) v1(38.77,36.06) v1(38.77,34.39) v1(38.77,32.9) v1(38.77,30.5) v1(38.77,28.39) v1(38.77,25.96) v1(38.77,24.02) v1(38.77,21.9) v1(38.87,1.16) v1(39.1,48.39) v1(39.16,80.84) v1(39.23,39.94) v1(39.36,87.48) v1(39.42,63.87) v1(39.42,62.99) v1(39.42,62.07) v1(39.38,2.77) v1(39.68,75.68) v1(39.94,41.61) v1(40.19,39.16) v1(40.26,17.1) v1(40.26,14.32) v1(40.26,7.35) v1(40.52,19.94) v1(40.9,40.71) v1(41.08,91.69) v1(41.2,1.16) v1(41.43,48.39) v1(41.71,2.77) v1(41.85,83.46) v1(41.85,78.21) v1(41.85,75.68) v1(41.85,74.64) v1(42.19,39.55) v1(42.19,38.19) v1(42.19,36.17) v1(42.19,34.61) v1(42.19,32.56) v1(42.59,17.1) v1(42.59,14.32) v1(42.59,7.35) v1(42.99,19.94) v1(43.53,1.16) v1(43.89,78.21) v1(44.04,2.77) v1(44.26,49.23) v1(44.26,46.9) v1(44.26,44.7) v1(44.37,75.68) v1(44.39,74.64) v1(44.57,87.48) v1(44.92,17.1) v1(44.92,14.32) v1(44.92,7.35) v1(45.23,42.07) v1(45.23,39.74) v1(45.23,37.41) v1(45.23,35.75) v1(45.23,33.42) v1(45.23,31.09) v1(45.56,96.47) v1(45.84,19.94) v1(45.86,1.16) v1(46.01,78.21) v1(47.25,17.1) v1(47.25,7.35) v1(47.82,28.35) v1(47.82,24.3) v1(47.91,81.29) v1(47.91,79.54) v1(47.91,78.21) v1(47.87,42.91) v1(47.87,40.58) v1(47.87,38.25) v1(47.87,36.46) v1(47.87,34.13) v1(47.87,31.8) v1(48.19,1.16) v1(49.62,87.48) v1(50.52,1.16) v1(51.02,66.77) v1(51.02,65.9) v1(51.02,65.19) v1(51.34,91.76) v1(51.74,81.81) v1(52.68,1.16) v1(53.53,98.28) v1(53.48,83.74) v1(54.06,17.81) v1(54.7,87.55) v1(54.9,85.23) v1(55.01,1.16) v1(55.23,18.84) v1(56.26,86.45) v1(56.45,20.06) v1(56.62,61.85) v1(56.79,98.28) v1(57.34,1.16) v1(57.48,87.68) v1(57.48,21.23) v1(58.45,98.28) v1(58.45,96.19) v1(58.77,88.84) v1(59.4,8.38) v1(59.4,3.88) v1(59.67,1.16) v1(59.82,65.9) v1(59.94,90.19) v1(59.94,22.45) v1(60.26,35.61) v1(60.26,32.91) v1(60.26,30.19) v1(60.78,94) v1(61.16,8.25) v1(62,1.16) v1(62.26,95.9) v1(62.52,37.87) v1(63.82,61.85) v1(64.29,1.16) v1(64.77,39.81) v1(66.6,98.25) v1(66.62,1.16) v1(66.72,14.16) v1(66.69,8.38) v1(66.69,3.88) v1(66.9,41.55) v1(67.02,65.9) v1(67.82,28.35) v1(68.45,8.25) v1(68.62,24.57) v1(68.95,1.16) v1(69.23,97.03) v1(69.23,95.38) v1(69.22,43.87) v1(70.24,11.87) v1(70.51,19.68) v1(70.51,18.19) v1(70.98,86.62) v1(70.98,85.47) v1(70.98,83.92) v1(71.02,61.85) v1(71.1,14.16) v1(71.23,59.3) v1(71.23,56.97) v1(71.23,54.64) v1(71.28,97.03) v1(71.28,95.38) v1(71.29,52.72) v1(71.29,50.39) v1(71.29,48.06) v1(71.28,1.16) v1(71.55,43.87) v1(72.11,10) v1(72.38,32.19) v1(72.38,30.84) v1(72.45,91.93) v1(72.45,90.53) v1(72.45,89.13) v1(72.65,45.35) v1(72.58,11.87) v1(72.84,19.68) v1(72.84,18.19) v1(73.33,97.03) v1(73.33,95.38) v1(73.32,86.62) v1(73.32,85.47) v1(73.32,83.92) v1(73.42,28.35) v1(73.61,1.16) v1(73.85,91.93) v1(73.85,90.53) v1(73.85,89.13) v1(73.88,43.87) v1(74.11,8.19) v1(74.11,3.69) v1(74.22,28.35) v1(74.22,24.3) v1(74.45,10) v1(74.71,32.19) v1(74.71,30.84) v1(74.72,11.87) v1(75.02,28.35) v1(75.02,24.3) v1(75.17,19.68) v1(75.17,18.19) v1(75.25,91.93) v1(75.25,90.53) v1(75.25,89.13) v1(75.39,97.03) v1(75.39,95.38) v1(75.45,86.62) v1(75.45,85.47) v1(75.45,83.92) v1(75.62,14.11) v1(75.82,28.35) v1(75.82,24.3) v1(75.81,8.06) v1(75.94,1.16) v1(76.62,28.35) v1(76.62,24.3) v1(76.59,10) v1(76.72,91.1) v1(76.72,88.75) v1(76.72,86.62) v1(77.04,32.19) v1(77.04,30.84) v1(77.33,1.16) v1(77.44,97.03) v1(77.44,95.38) v1(77.42,28.35) v1(77.42,24.3) v1(77.68,22.65) v1(77.68,21.66) v1(77.68,20.85) v1(77.68,19.66) v1(78.11,92.79) v1(78.22,28.35) v1(78.58,91.1) v1(78.58,88.75) v1(78.58,86.62) v1(78.77,18.32) v1(79.15,69.48) v1(79.49,97.03) v1(79.49,95.38) v1(79.66,1.16) v1(79.87,17.23) v1(80.45,92.79) v1(80.45,91.1) v1(80.45,88.75) v1(80.45,86.62) v1(80.62,65.9) v1(80.61,64.47) v1(80.61,63.54) v1(80.58,62.64) v1(81.24,8.07) v1(81.24,3.57) v1(81.42,65.9) v1(81.41,64.47) v1(81.41,63.54) v1(81.41,62.64) v1(81.55,97.03) v1(81.55,95.38) v1(81.48,69.48) v1(81.99,1.16) v1(82.19,91.1) v1(82.19,88.75) v1(82.19,86.62) v1(82.22,65.9) v1(82.21,64.47) v1(82.21,63.54) v1(82.21,62.64) v1(82.26,17.87) v1(82.45,14.26) v1(82.59,92.79) v1(82.9,7.99) v1(83.02,65.9) v1(83.01,64.47) v1(83.01,63.54) v1(83.03,62.64) v1(83.48,13.16) v1(83.61,16.58) v1(83.81,69.48) v1(84.1,98.25) v1(84.32,1.16) v1(84.52,12.26) v1(84.58,15.55) v1(85.23,5.81) v1(85.23,4.12) v1(85.55,14.58) v1(85.74,11.1) v1(85.86,69.55) v1(86.52,13.55) v1(86.65,1.16) v1(86.84,10.06) v1(87.22,5.81) v1(87.22,4.12) v1(87.35,64) v1(87.49,85.59) v1(87.49,81.46) v1(87.67,13.48) v1(87.74,11.29) v1(87.8,8.77) v1(88.19,69.55) v1(88.93,1.16) v1(88.98,5.81) v1(88.98,4.09) v1(89.54,87.35) v1(89.67,77.35) v1(89.68,64) v1(90.04,94.32) v1(90.04,93.2) v1(90,13.48) v1(90.06,11.29) v1(90.13,8.77) v1(90.52,69.55) v1(90.97,5.81) v1(90.97,4.09) v1(91.26,1.16) v1(91.99,85.59) v1(91.99,81.46) v1(92.01,64) v1(92.33,13.48) v1(92.39,94.32) v1(92.39,93.2) v1(92.39,11.29) v1(92.46,8.77) v1(93.59,1.16) v1(93.66,76.77) v1(93.66,75.63) v1(93.66,74.28) v1(93.66,72.98) v1(94.52,94.32) v1(94.52,93.2) v1(95.92,1.16) v1(96,76.77) v1(96,75.63) v1(96,74.28) v1(96,72.98) v1(96.97,14.47) v1(96.97,13.49) v1(96.97,12.51) v1(96.97,11.53) v1(96.97,10.52) v1(96.97,9.54) v1(98.13,88.34) v1(98.13,86) v1(98.13,83.86) v1(98.13,82.33) v1(98.13,79.98) v1(98.13,77.85) v1(98.14,76.77) v1(98.14,75.63) v1(98.14,74.28) v1(98.14,72.98) v1(98.25,1.16) v1(98.49,16.53) v1(98.49,15.55) v1(98.49,14.53) v1(98.49,13.55) v1(98.49,12.51) v1(98.49,11.53) v1(98.49,10.52) v1(98.49,9.54) v2(4.13,14.19) v2(4.13,13.29) v2(4.13,12.37) v2(24.87,99.23) v2(26.47,99.23) v2(28.08,99.23) v2(29.69,99.23) v2(31.29,99.23) v2(32.9,99.23) v2(34.51,99.23) v2(36.11,99.23) v2(37.72,99.23) v2(39.33,99.23) v2(40.94,99.23) v2(42.54,99.23) v2(44.15,99.23) v2(45.76,99.23) v2(47.36,99.23) v2(48.97,99.23)
VBUS_EN: length 10.2
  Top Layer w0.178: 18.28,17.16 18.28,17.34 17.8,17.81 R41.2 16.75,17.81 13.42,17.81 12.06,16.45 12.06,14.39 12.44,14.01 U8.17
BK13_T5: length 45.2
  Top Layer w0.152: U16.34 95.04,61.55 94.56,61.55 93.21,60.19 92.85,60.19 arc(92.66,60.27) 92.59,60.46 92.59,62.41 arc(92.32,62.68) 92.05,62.41 92.05,60.46 arc(91.78,60.19) 91.52,60.46 91.52,62.41 arc(91.25,62.68) 90.99,62.41 90.99,60.46 arc(90.72,60.19) 90.45,60.46 90.45,62.41 arc(90.19,62.68) 89.92,62.41 89.92,60.46 arc(89.65,60.19) 89.38,60.46 89.38,62.41 arc(89.12,62.68) 88.85,62.41 88.85,60.46 arc(88.58,60.19) 88.32,60.46 88.32,62.41 arc(88.05,62.68) 87.78,62.41 87.78,60.46 arc(87.52,60.19) 87.25,60.46 87.25,62.41 arc(86.98,62.68) 86.72,62.41 86.72,60.46 arc(86.64,60.27) 86.45,60.19 79.42,60.19 79.02,60.59 CN2.12
BK13_T9: length 45.2
  Top Layer w0.152: U16.20 95.01,43.74 93.08,43.74 arc(92.92,43.81) 92.85,43.97 92.85,44.08 arc(92.62,44.3) 92.39,44.08 92.39,43.97 arc(92.16,43.74) 91.94,43.97 91.94,44.08 arc(91.71,44.3) 91.48,44.08 91.48,43.97 arc(91.25,43.74) 91.02,43.97 91.02,44.08 arc(90.79,44.3) 90.56,44.08 90.56,43.97 arc(90.34,43.74) 90.11,43.97 90.11,44.08 arc(89.88,44.3) 89.65,44.08 89.65,43.97 arc(89.42,43.74) 89.19,43.97 89.19,44.08 arc(88.96,44.31) 88.74,44.08 88.74,43.97 arc(88.51,43.74) 88.28,43.97 88.28,44.08 arc(88.05,44.3) 87.82,44.08 87.82,43.97 arc(87.59,43.74) 87.36,43.97 87.36,44.08 arc(87.14,44.3) 86.91,44.08 86.91,43.97 arc(86.68,43.74) 86.45,43.97 86.45,44.08 arc(86.22,44.3) 85.99,44.08 85.99,43.97 arc(85.76,43.74) 85.54,43.97 85.54,44.08 arc(85.31,44.3) 85.08,44.08 85.08,43.97 arc(85.01,43.81) 84.85,43.74 76.13,43.74 72.62,47.25 CN2.28
BK13_U5: length 45.2
  Inner2 w0.152: v1(78.22,61.85) 78.22,60.43 79.16,59.48 84.71,59.48 arc(84.9,59.56) 84.98,59.75 84.98,60.89 arc(85.25,61.15) 85.51,60.89 85.51,59.75 arc(85.78,59.48) 86.05,59.75 86.05,60.89 arc(86.31,61.15) 86.58,60.89 86.58,59.75 arc(86.85,59.48) 87.11,59.75 87.11,60.89 arc(87.38,61.15) 87.65,60.89 87.65,59.75 arc(87.91,59.48) 88.18,59.75 88.18,60.89 arc(88.45,61.15) 88.71,60.89 88.71,59.75 arc(88.98,59.48) 89.25,59.75 89.25,60.89 arc(89.51,61.15) 89.78,60.89 89.78,59.75 arc(90.05,59.48) 90.31,59.75 90.31,60.89 arc(90.58,61.15) 90.85,60.89 90.85,59.75 arc(91.12,59.48) 91.38,59.75 91.38,60.89 arc(91.65,61.15) 91.91,60.89 91.91,59.75 arc(92.18,59.48) 92.45,59.75 92.45,60.89 arc(92.72,61.15) 92.98,60.89 92.98,59.75 arc(93.06,59.56) 93.25,59.48 93.6,59.48 94.44,60.32 96.35,60.32 U16.33
BK13_U7: length 45.1
  Top Layer w0.152: U16.31 97.59,59.08 96.32,57.81 93.89,57.81 arc(93.7,57.88) 93.63,58.07 93.63,58.59 arc(93.36,58.85) 93.09,58.59 93.09,58.07 arc(92.83,57.81) 92.56,58.07 92.56,58.59 arc(92.29,58.85) 92.03,58.59 92.03,58.07 arc(91.76,57.81) 91.49,58.07 91.49,58.59 arc(91.23,58.85) 90.96,58.59 90.96,58.07 arc(90.69,57.81) 90.43,58.07 90.43,58.59 arc(90.16,58.85) 89.89,58.59 89.89,58.07 arc(89.63,57.81) 89.36,58.07 89.36,58.59 arc(89.09,58.85) 88.83,58.59 88.83,58.07 arc(88.56,57.81) 88.29,58.07 88.29,58.59 arc(88.03,58.85) 87.76,58.59 87.76,58.07 arc(87.49,57.81) 87.23,58.07 87.23,58.59 arc(86.96,58.85) 86.69,58.59 86.69,58.07 arc(86.43,57.81) 86.16,58.07 86.16,58.59 arc(85.89,58.85) 85.62,58.59 85.62,58.07 arc(85.36,57.81) 85.09,58.07 85.09,58.59 arc(84.82,58.85) 84.56,58.59 84.56,58.07 arc(84.29,57.81) 84.03,58.07 84.03,58.59 arc(83.76,58.85) 83.49,58.59 83.49,58.07 arc(83.22,57.81) 82.96,58.07 82.96,58.59 arc(82.69,58.85) 82.43,58.59 82.43,58.07 arc(82.16,57.81) 81.89,58.07 81.89,58.59 arc(81.62,58.85) 81.36,58.59 81.36,58.07 arc(81.09,57.81) 80.82,58.07 80.82,58.59 arc(80.56,58.85) 80.29,58.59 80.29,58.07 arc(80.21,57.88) 80.02,57.81 79.03,57.81 77.42,59.42 CN2.16
BK13_U8: length 45.2
  Top Layer w0.152: U16.23 96.41,47.68 93.87,47.68 arc(93.71,47.74) 93.64,47.91 93.64,48.05 arc(93.41,48.28) 93.19,48.05 93.19,47.91 arc(92.96,47.68) 92.73,47.91 92.73,48.05 arc(92.5,48.28) 92.27,48.05 92.27,47.91 arc(92.04,47.68) 91.81,47.91 91.81,48.05 arc(91.59,48.28) 91.36,48.05 91.36,47.91 arc(91.13,47.68) 90.9,47.91 90.9,48.05 arc(90.67,48.28) 90.44,48.05 90.44,47.91 arc(90.21,47.68) 89.99,47.91 89.99,48.05 arc(89.76,48.28) 89.53,48.05 89.53,47.91 arc(89.3,47.68) 89.07,47.91 89.07,48.05 arc(88.84,48.28) 88.61,48.05 88.61,47.91 arc(88.39,47.68) 88.16,47.91 88.16,48.05 arc(87.93,48.28) 87.7,48.05 87.7,47.91 arc(87.47,47.68) 87.24,47.91 87.24,48.05 arc(87.01,48.28) 86.79,48.05 86.79,47.91 arc(86.56,47.68) 86.33,47.91 86.33,48.05 arc(86.1,48.28) 85.87,48.05 85.87,47.91 arc(85.64,47.68) 85.41,47.91 85.41,48.05 arc(85.19,48.28) 84.96,48.05 84.96,47.91 arc(84.73,47.68) 84.5,47.91 84.5,48.05 arc(84.27,48.28) 84.04,48.05 84.04,47.91 arc(83.81,47.68) 83.59,47.91 83.59,48.05 arc(83.36,48.28) 83.13,48.05 83.13,47.91 arc(82.9,47.68) 82.67,47.91 82.67,48.05 arc(82.44,48.28) 82.21,48.05 82.21,47.91 arc(82.15,47.74) 81.99,47.68 80,47.68 74.22,53.46 CN2.24
BK13_U9: length 45.2
  Inner2 w0.152: v1(73.42,61.85) 73.42,51.23 79.55,45.1 84.49,45.1 arc(84.65,45.16) 84.72,45.33 84.72,45.43 arc(84.95,45.66) 85.18,45.43 85.18,45.33 arc(85.41,45.1) 85.64,45.33 85.64,45.43 arc(85.86,45.66) 86.09,45.43 86.09,45.33 arc(86.32,45.1) 86.55,45.33 86.55,45.43 arc(86.78,45.66) 87.01,45.43 87.01,45.33 arc(87.24,45.1) 87.46,45.33 87.46,45.43 arc(87.69,45.66) 87.92,45.43 87.92,45.33 arc(88.15,45.1) 88.38,45.33 88.38,45.43 arc(88.61,45.66) 88.84,45.43 88.84,45.33 arc(89.06,45.1) 89.29,45.33 89.29,45.43 arc(89.52,45.66) 89.75,45.43 89.75,45.33 arc(89.98,45.1) 90.21,45.33 90.21,45.43 arc(90.44,45.66) 90.66,45.43 90.66,45.33 arc(90.89,45.1) 91.12,45.33 91.12,45.43 arc(91.35,45.66) 91.58,45.43 91.58,45.33 arc(91.81,45.1) 92.04,45.33 92.04,45.43 arc(92.26,45.66) 92.49,45.43 92.49,45.33 arc(92.72,45.1) 92.95,45.33 92.95,45.43 arc(93.18,45.66) 93.41,45.43 93.41,45.33 arc(93.47,45.16) 93.64,45.1 96.37,45.1 U16.21
BK13_V5: length 19.2
  Top Layer w0.152: U16.36 95.02,64.06 93.61,64.06 89.94,67.74 79.55,67.74 79.02,67.21 CN2.11
BK13_V6: length 22.9
  Top Layer w0.152: U16.35 96.39,65.42 93.61,65.42 90.71,68.32 79.35,68.32 78.22,67.19 CN2.13
BK13_V7: length 45.2
  Inner2 w0.152: v1(76.6,61.85) 76.6,58.18 79.48,55.29 79.93,55.29 arc(80.11,55.37) 80.19,55.56 80.19,55.97 arc(80.46,56.24) 80.72,55.97 80.72,55.56 arc(80.99,55.29) 81.26,55.56 81.26,55.97 arc(81.53,56.24) 81.79,55.97 81.79,55.56 arc(82.06,55.29) 82.33,55.56 82.33,55.97 arc(82.59,56.24) 82.86,55.97 82.86,55.56 arc(83.13,55.29) 83.39,55.56 83.39,55.97 arc(83.66,56.24) 83.93,55.97 83.93,55.56 arc(84.19,55.29) 84.46,55.56 84.46,55.97 arc(84.73,56.24) 84.99,55.97 84.99,55.56 arc(85.26,55.29) 85.53,55.56 85.53,55.97 arc(85.79,56.24) 86.06,55.97 86.06,55.56 arc(86.33,55.29) 86.59,55.56 86.59,55.97 arc(86.86,56.24) 87.13,55.97 87.13,55.56 arc(87.39,55.29) 87.66,55.56 87.66,55.97 arc(87.93,56.24) 88.19,55.97 88.19,55.56 arc(88.46,55.29) 88.73,55.56 88.73,55.97 arc(88.99,56.24) 89.26,55.97 89.26,55.56 arc(89.53,55.29) 89.79,55.56 89.79,55.97 arc(90.06,56.24) 90.33,55.97 90.33,55.56 arc(90.59,55.29) 90.86,55.56 90.86,55.97 arc(91.13,56.24) 91.39,55.97 91.39,55.56 arc(91.66,55.29) 91.93,55.56 91.93,55.97 arc(92.19,56.24) 92.46,55.97 92.46,55.56 arc(92.73,55.29) 92.99,55.56 92.99,55.97 arc(93.26,56.24) 93.53,55.97 93.53,55.56 arc(93.6,55.37) 93.79,55.29 96.32,55.29 97.57,56.54 U16.29
BK13_V8: length 45.1
  Top Layer w0.152: U16.27 97.65,53.58 96.77,52.71 93.76,52.71 arc(93.57,52.79) 93.5,52.98 93.5,53.33 arc(93.23,53.6) 92.96,53.33 92.96,52.98 arc(92.69,52.71) 92.43,52.98 92.43,53.33 arc(92.16,53.6) 91.9,53.33 91.9,52.98 arc(91.63,52.71) 91.36,52.98 91.36,53.33 arc(91.09,53.6) 90.83,53.33 90.83,52.98 arc(90.56,52.71) 90.29,52.98 90.29,53.33 arc(90.03,53.6) 89.76,53.33 89.76,52.98 arc(89.49,52.71) 89.23,52.98 89.23,53.33 arc(88.96,53.6) 88.69,53.33 88.69,52.98 arc(88.43,52.71) 88.16,52.98 88.16,53.33 arc(87.89,53.6) 87.63,53.33 87.63,52.98 arc(87.36,52.71) 87.09,52.98 87.09,53.33 arc(86.83,53.6) 86.56,53.33 86.56,52.98 arc(86.29,52.71) 86.03,52.98 86.03,53.33 arc(85.76,53.6) 85.49,53.33 85.49,52.98 arc(85.23,52.71) 84.96,52.98 84.96,53.33 arc(84.69,53.6) 84.43,53.33 84.43,52.98 arc(84.16,52.71) 83.89,52.98 83.89,53.33 arc(83.63,53.6) 83.36,53.33 83.36,52.98 arc(83.09,52.71) 82.83,52.98 82.83,53.33 arc(82.56,53.6) 82.29,53.33 82.29,52.98 arc(82.03,52.71) 81.76,52.98 81.76,53.33 arc(81.49,53.6) 81.23,53.33 81.23,52.98 arc(81.15,52.79) 80.96,52.71 79.94,52.71 75.82,56.83 CN2.20
BK13_W6: length 45.2
  Inner3 w0.152: v1(77.42,65.9) 77.77,65.55 77.77,59.97 79.16,58.58 79.95,58.58 arc(80.14,58.66) 80.21,58.85 80.21,59.35 arc(80.48,59.62) 80.75,59.35 80.75,58.85 arc(81.01,58.58) 81.28,58.85 81.28,59.35 arc(81.55,59.62) 81.81,59.35 81.81,58.85 arc(82.08,58.58) 82.35,58.85 82.35,59.35 arc(82.61,59.62) 82.88,59.35 82.88,58.85 arc(83.15,58.58) 83.41,58.85 83.41,59.35 arc(83.68,59.62) 83.95,59.35 83.95,58.85 arc(84.21,58.58) 84.48,58.85 84.48,59.35 arc(84.75,59.62) 85.01,59.35 85.01,58.85 arc(85.28,58.58) 85.55,58.85 85.55,59.35 arc(85.81,59.62) 86.08,59.35 86.08,58.85 arc(86.35,58.58) 86.62,58.85 86.62,59.35 arc(86.88,59.62) 87.15,59.35 87.15,58.85 arc(87.41,58.58) 87.68,58.85 87.68,59.35 arc(87.95,59.62) 88.22,59.35 88.22,58.85 arc(88.48,58.58) 88.75,58.85 88.75,59.35 arc(89.02,59.62) 89.28,59.35 89.28,58.85 arc(89.55,58.58) 89.82,58.85 89.82,59.35 arc(90.08,59.62) 90.35,59.35 90.35,58.85 arc(90.62,58.58) 90.88,58.85 90.88,59.35 arc(91.15,59.62) 91.42,59.35 91.42,58.85 arc(91.68,58.58) 91.95,58.85 91.95,59.35 arc(92.22,59.62) 92.48,59.35 92.48,58.85 arc(92.75,58.58) 93.02,58.85 93.02,59.35 arc(93.28,59.62) 93.55,59.35 93.55,58.85 arc(93.63,58.66) 93.82,58.58 94.61,58.58 U16.32
BK13_W8: length 45.2
  Inner2 w0.152: v1(75.02,61.85) 75.02,55.56 80.45,50.13 81.07,50.13 arc(81.26,50.21) 81.34,50.4 81.34,50.65 arc(81.6,50.92) 81.87,50.65 81.87,50.4 arc(82.14,50.13) 82.4,50.4 82.4,50.65 arc(82.67,50.92) 82.94,50.65 82.94,50.4 arc(83.2,50.13) 83.47,50.4 83.47,50.65 arc(83.74,50.92) 84,50.65 84,50.4 arc(84.27,50.13) 84.54,50.4 84.54,50.65 arc(84.8,50.92) 85.07,50.65 85.07,50.4 arc(85.34,50.13) 85.6,50.4 85.6,50.65 arc(85.87,50.92) 86.14,50.65 86.14,50.4 arc(86.4,50.13) 86.67,50.4 86.67,50.65 arc(86.94,50.92) 87.2,50.65 87.2,50.4 arc(87.47,50.13) 87.74,50.4 87.74,50.65 arc(88,50.92) 88.27,50.65 88.27,50.4 arc(88.54,50.13) 88.8,50.4 88.8,50.65 arc(89.07,50.92) 89.34,50.65 89.34,50.4 arc(89.6,50.13) 89.87,50.4 89.87,50.65 arc(90.14,50.92) 90.4,50.65 90.4,50.4 arc(90.67,50.13) 90.94,50.4 90.94,50.65 arc(91.2,50.92) 91.47,50.65 91.47,50.4 arc(91.74,50.13) 92,50.4 92,50.65 arc(92.27,50.92) 92.54,50.65 92.54,50.4 arc(92.81,50.13) 93.07,50.4 93.07,50.65 arc(93.34,50.92) 93.6,50.65 93.6,50.4 arc(93.68,50.21) 93.87,50.13 96.45,50.13 97.65,51.33 U16.25
BK13_W9: length 45.2
  Inner4 w0.152: v1(73.42,65.9) 73.9,65.41 73.9,52.55 80.13,46.32 85.42,46.32 arc(85.58,46.39) 85.65,46.55 85.65,46.73 arc(85.88,46.95) 86.1,46.73 86.1,46.55 arc(86.33,46.32) 86.56,46.55 86.56,46.73 arc(86.79,46.95) 87.02,46.73 87.02,46.55 arc(87.25,46.32) 87.48,46.55 87.48,46.73 arc(87.7,46.95) 87.93,46.73 87.93,46.55 arc(88.16,46.32) 88.39,46.55 88.39,46.73 arc(88.62,46.95) 88.85,46.73 88.85,46.55 arc(89.08,46.32) 89.3,46.55 89.3,46.73 arc(89.53,46.95) 89.76,46.73 89.76,46.55 arc(89.99,46.32) 90.22,46.55 90.22,46.73 arc(90.45,46.95) 90.68,46.73 90.68,46.55 arc(90.9,46.32) 91.13,46.55 91.13,46.73 arc(91.36,46.95) 91.59,46.73 91.59,46.55 arc(91.82,46.32) 92.05,46.55 92.05,46.73 arc(92.28,46.95) 92.5,46.73 92.5,46.55 arc(92.73,46.32) 92.96,46.55 92.96,46.73 arc(93.19,46.95) 93.42,46.73 93.42,46.55 arc(93.49,46.39) 93.65,46.32 95.05,46.32 U16.22
BK13_W10: length 45.2
  Bottom Layer w0.152: v1(72.62,65.9) 72.94,65.58 72.94,48.48 76.32,45.1 77.02,45.1 arc(77.18,45.03) 77.25,44.87 arc(77.31,44.71) 77.47,44.64 77.48,44.64 arc(77.64,44.71) 77.7,44.87 arc(77.77,45.03) 77.93,45.1 77.93,45.1 arc(78.09,45.03) 78.16,44.87 arc(78.23,44.71) 78.39,44.64 78.39,44.64 arc(78.55,44.71) 78.62,44.87 arc(78.68,45.03) 78.84,45.1 96.39,45.1 U16.19
BK13_Y6: length 45.1
  Inner4 w0.152: U16.30 95,56.64 93.66,56.64 arc(93.47,56.72) 93.39,56.91 93.39,57.33 arc(93.12,57.6) 92.86,57.33 92.86,56.91 arc(92.59,56.64) 92.32,56.91 92.32,57.33 arc(92.06,57.6) 91.79,57.33 91.79,56.91 arc(91.52,56.64) 91.26,56.91 91.26,57.33 arc(90.99,57.6) 90.72,57.33 90.72,56.91 arc(90.46,56.64) 90.19,56.91 90.19,57.33 arc(89.92,57.6) 89.66,57.33 89.66,56.91 arc(89.39,56.64) 89.12,56.91 89.12,57.33 arc(88.86,57.6) 88.59,57.33 88.59,56.91 arc(88.32,56.64) 88.06,56.91 88.06,57.33 arc(87.79,57.6) 87.52,57.33 87.52,56.91 arc(87.26,56.64) 86.99,56.91 86.99,57.33 arc(86.72,57.6) 86.46,57.33 86.46,56.91 arc(86.19,56.64) 85.92,56.91 85.92,57.33 arc(85.66,57.6) 85.39,57.33 85.39,56.91 arc(85.12,56.64) 84.86,56.91 84.86,57.33 arc(84.59,57.6) 84.32,57.33 84.32,56.91 arc(84.06,56.64) 83.79,56.91 83.79,57.33 arc(83.52,57.6) 83.25,57.33 83.25,56.91 arc(82.99,56.64) 82.72,56.91 82.72,57.33 arc(82.46,57.6) 82.19,57.33 82.19,56.91 arc(81.92,56.64) 81.66,56.91 81.66,57.33 arc(81.39,57.6) 81.12,57.33 81.12,56.91 arc(80.85,56.64) 80.59,56.91 80.59,57.33 arc(80.32,57.6) 80.05,57.33 80.05,56.91 arc(79.98,56.72) 79.79,56.64 79.29,56.64 77.09,58.85 77.09,65.43 v1(76.62,65.9)
BK13_Y7: length 45.2
  Inner3 w0.152: v1(75.82,65.9) 76.15,65.56 76.15,57.46 79.55,54.06 80.79,54.06 arc(80.98,54.14) 81.06,54.33 81.06,54.7 arc(81.33,54.97) 81.59,54.7 81.59,54.33 arc(81.86,54.06) 82.13,54.33 82.13,54.7 arc(82.4,54.97) 82.66,54.7 82.66,54.33 arc(82.93,54.06) 83.2,54.33 83.2,54.7 arc(83.46,54.97) 83.73,54.7 83.73,54.33 arc(84,54.06) 84.26,54.33 84.26,54.7 arc(84.53,54.97) 84.8,54.7 84.8,54.33 arc(85.06,54.06) 85.33,54.33 85.33,54.7 arc(85.6,54.97) 85.86,54.7 85.86,54.33 arc(86.13,54.06) 86.4,54.33 86.4,54.7 arc(86.66,54.97) 86.93,54.7 86.93,54.33 arc(87.2,54.06) 87.46,54.33 87.46,54.7 arc(87.73,54.97) 88,54.7 88,54.33 arc(88.26,54.06) 88.53,54.33 88.53,54.7 arc(88.8,54.97) 89.06,54.7 89.06,54.33 arc(89.33,54.06) 89.6,54.33 89.6,54.7 arc(89.86,54.97) 90.13,54.7 90.13,54.33 arc(90.4,54.06) 90.66,54.33 90.66,54.7 arc(90.93,54.97) 91.2,54.7 91.2,54.33 arc(91.46,54.06) 91.73,54.33 91.73,54.7 arc(92,54.97) 92.26,54.7 92.26,54.33 arc(92.53,54.06) 92.8,54.33 92.8,54.7 arc(93.06,54.97) 93.33,54.7 93.33,54.33 arc(93.41,54.14) 93.6,54.06 95.04,54.06 U16.28
